# Altium project Kojiki.PrjPCB (part 1 of 2)
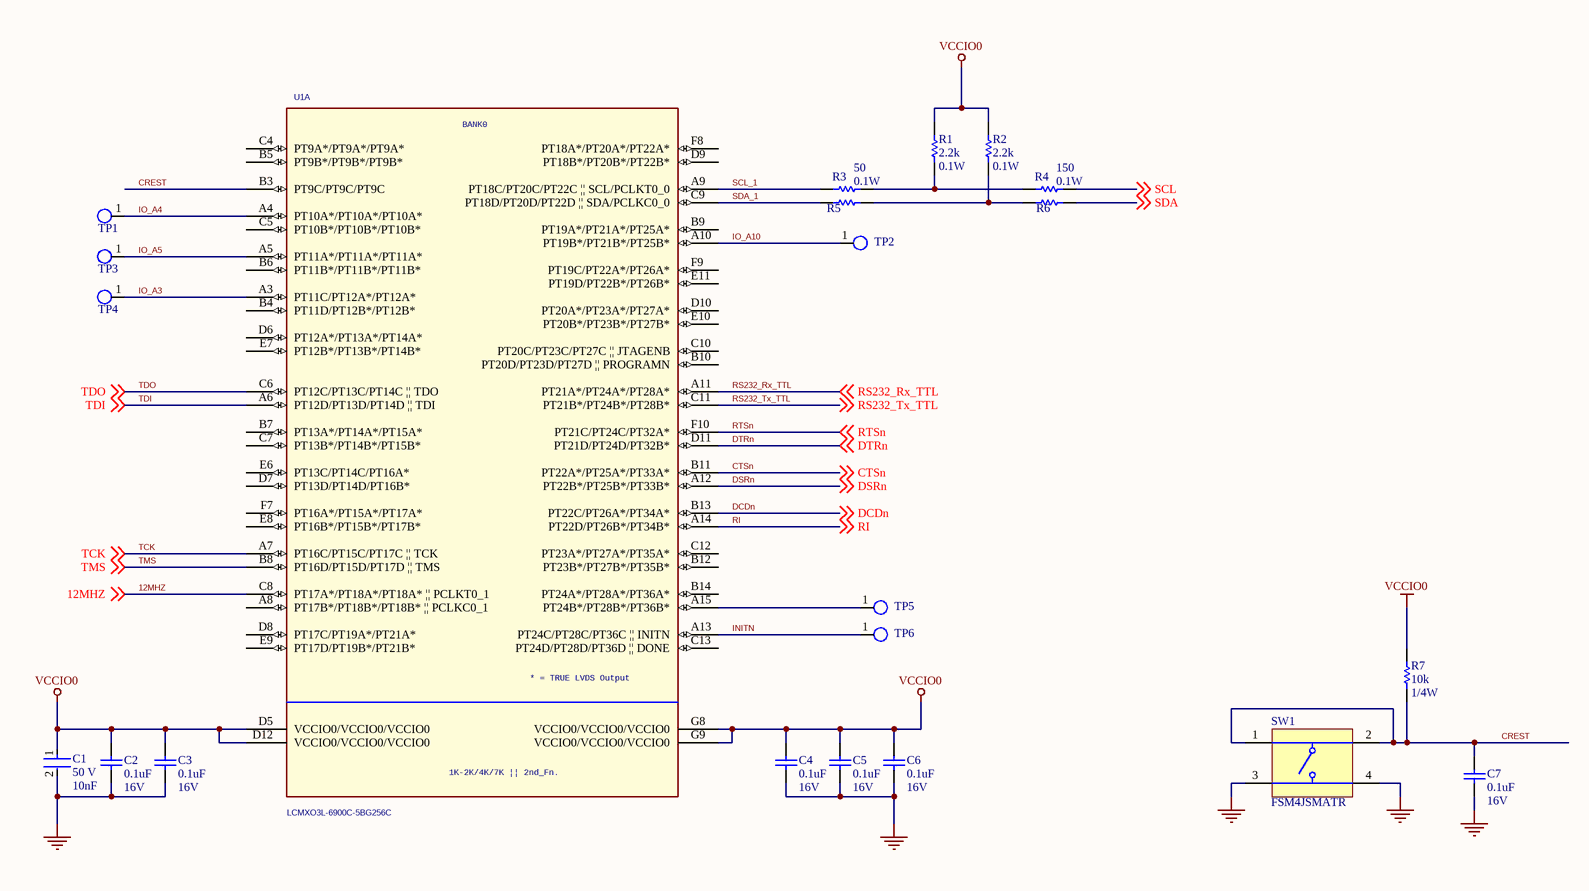
[diagram p0: Bank0_I_O.SchDoc]
10 sheets, 266 parts. Net scope: global (net labels, ports and power ports of the same name join across sheets).
Board file: Kojiki.PcbDoc
Sheets:
  Bank0_I_O.SchDoc
  Bank1_I_O.SchDoc
  Bank2_I_O.SchDoc
  Bank3-4-5_I_O.SchDoc
  bluetooth.SchDoc
  DC-DC-Converters.SchDoc
  Power_Decap.SchDoc
  usb2jtag.SchDoc
  analog_front_end.SchDoc
  Accelerometer.SchDoc

## Sheet Bank0_I_O.SchDoc
size A3

### Parts
C1  value 10nF  Voltage: 50 V  [FP-C0805C-DN-MFG]  (hidden comment: C0805C103K5RACAUTO)
C2  value 0.1uF  Voltage: 16V  [CAPC1608X87X35ML15T15]  (hidden comment: C0603C104M4RACTU)
C3  value 0.1uF  Voltage: 16V  [CAPC1608X87X35ML15T15]  (hidden comment: C0603C104M4RACTU)
C4  value 0.1uF  Voltage: 16V  [CAPC1608X87X35ML15T15]  (hidden comment: C0603C104M4RACTU)
C5  value 0.1uF  Voltage: 16V  [CAPC1608X87X35ML15T15]  (hidden comment: C0603C104M4RACTU)
C6  value 0.1uF  Voltage: 16V  [CAPC1608X87X35ML15T15]  (hidden comment: C0603C104M4RACTU)
C7  value 0.1uF  Voltage: 16V  [CAPC1608X87X35ML15T15]  (hidden comment: C0603C104M4RACTU)
R1  value 2.2k  Power: 0.1W  [RESC1608X55X25LL10T15]  (hidden comment: RC0603FR-072K2L)
R2  value 2.2k  Power: 0.1W  [RESC1608X55X25LL10T15]  (hidden comment: RC0603FR-072K2L)
R3  value 50  Power: 0.1W  [RESC1609X50X30NL10T20]  (hidden comment: CRCW060350R0FKEA)
R4  value 150  Power: 0.1W  [RESC1608X55X30NL15T15]  (hidden comment: ERJ-3EKF1500V)
R5  CRCW060350R0FKEA  [RESC1609X50X30NL10T20]  (value not drawn)
R6  ERJ-3EKF1500V  [RESC1608X55X30NL15T15]  (value not drawn)
R7  value 10k  Power: 1/4W  [RESC3216X70X50NL05T20]  (hidden comment: ERJ-8GEYJ103V)
SW1  FSM4JSMATR  [TECO-FSM4JSMATR_V]
TP1  Test_Point_SMD  [Test_Point_SMD]  (value not drawn)
TP2  Test_Point_SMD  [Test_Point_SMD]  (value not drawn)
TP3  Test_Point_SMD  [Test_Point_SMD]  (value not drawn)
TP4  Test_Point_SMD  [Test_Point_SMD]  (value not drawn)
TP5  Test_Point_SMD  [Test_Point_SMD]  (value not drawn)
TP6  Test_Point_SMD  [Test_Point_SMD]  (value not drawn)
U1  LCMXO3L-6900C-5BG256C  [BGA256C80P16X16_1400X1400X170]  (part A of 7)

### Nets
GND: C1.2 C2.2 C3.2 C4.2 C5.2 C6.2 C7.2 SW1.3 SW1.4
VCCIO0: C1.1 C2.1 C3.1 C4.1 C5.1 C6.1 R1.2 R2.2 R7.1 U1.D5(VCCIO0/VCCIO0/VCCIO0) U1.D12(VCCIO0/VCCIO0/VCCIO0) U1.G8(VCCIO0/VCCIO0/VCCIO0) U1.G9(VCCIO0/VCCIO0/VCCIO0)
12MHZ: U1.C8(PT17A*/PT18A*/PT18A*_||_PCLKT0_1) ; off-sheet 12MHZ
CREST: C7.1 R7.2 SW1.1 SW1.2 U1.B3(PT9C/PT9C/PT9C)
CTSn: U1.B11(PT22A*/PT25A*/PT33A*) ; off-sheet CTSn
DCDn: U1.B13(PT22C/PT26A*/PT34A*) ; off-sheet DCDn
DSRn: U1.A12(PT22B*/PT25B*/PT33B*) ; off-sheet DSRn
DTRn: U1.D11(PT21D/PT24D/PT32B*) ; off-sheet DTRn
INITN: TP6.1(TP) U1.A13(PT24C/PT28C/PT36C_||_INITN)
IO_A3: TP4.1(TP) U1.A3(PT11C/PT12A*/PT12A*)
IO_A4: TP1.1(TP) U1.A4(PT10A*/PT10A*/PT10A*)
IO_A5: TP3.1(TP) U1.A5(PT11A*/PT11A*/PT11A*)
IO_A10: TP2.1(TP) U1.A10(PT19B*/PT21B*/PT25B*)
RI: U1.A14(PT22D/PT26B*/PT34B*) ; off-sheet RI
RS232_Rx_TTL: U1.A11(PT21A*/PT24A*/PT28A*) ; off-sheet RS232_Rx_TTL
RS232_Tx_TTL: U1.C11(PT21B*/PT24B*/PT28B*) ; off-sheet RS232_Tx_TTL
RTSn: U1.F10(PT21C/PT24C/PT32A*) ; off-sheet RTSn
SCL: R4.2 ; off-sheet SCL
SCL_1: R3.1 U1.A9(PT18C/PT20C/PT22C_||_SCL/PCLKT0_0)
SDA: R6.2 ; off-sheet SDA
SDA_1: R5.1 U1.C9(PT18D/PT20D/PT22D_||_SDA/PCLKC0_0)
TCK: U1.A7(PT16C/PT15C/PT17C_||_TCK) ; off-sheet TCK
TDI: U1.A6(PT12D/PT13D/PT14D_||_TDI) ; off-sheet TDI
TDO: U1.C6(PT12C/PT13C/PT14C_||_TDO) ; off-sheet TDO
TMS: U1.B8(PT16D/PT15D/PT17D_||_TMS) ; off-sheet TMS
NetR1_1: R1.1 R3.2 R4.1
NetR2_1: R2.1 R5.2 R6.1
NetTP5_1: TP5.1(TP) U1.A15(PT24B*/PT28B*/PT36B*)

Not connected (* = marked no-connect by the designer): U1 A8(PT17B*/PT18B*/PT18B*_||_PCLKC0_1) B4(PT11D/PT12B*/PT12B*) B5(PT9B*/PT9B*/PT9B*) B6(PT11B*/PT11B*/PT11B*) B7(PT13A*/PT14A*/PT15A*) B9(PT19A*/PT21A*/PT25A*) B10(PT20D/PT23D/PT27D_||_PROGRAMN) B12(PT23B*/PT27B*/PT35B*) B14(PT24A*/PT28A*/PT36A*) C4(PT9A*/PT9A*/PT9A*) C5(PT10B*/PT10B*/PT10B*) C7(PT13B*/PT14B*/PT15B*) C10(PT20C/PT23C/PT27C_||_JTAGENB) C12(PT23A*/PT27A*/PT35A*) C13(PT24D/PT28D/PT36D_||_DONE) D6(PT12A*/PT13A*/PT14A*) D7(PT13D/PT14D/PT16B*) D8(PT17C/PT19A*/PT21A*) D9(PT18B*/PT20B*/PT22B*) D10(PT20A*/PT23A*/PT27A*) E6(PT13C/PT14C/PT16A*) E7(PT12B*/PT13B*/PT14B*) E8(PT16B*/PT15B*/PT17B*) E9(PT17D/PT19B*/PT21B*) E10(PT20B*/PT23B*/PT27B*) E11(PT19D/PT22B*/PT26B*) F7(PT16A*/PT15A*/PT17A*) F8(PT18A*/PT20A*/PT22A*) F9(PT19C/PT22A*/PT26A*)

### Notes on the sheet
- Title
- Size:
- Date:
- A3
- Number:
- Time:
- Revision:
- Sheet
- of
- File:
- (in symbol LCMXO3L-1K/2K/4K/7K-BG256, part A) BANK0; * = TRUE LVDS Output; 1K-2K/4K/7K || 2nd_Fn.

### Library data of the parts
C1 = CMP-03020-006206-1: CAP CER 10000PF 50V X7R 0805; Manufacturer: KEMET; Material: Ceramic; Temperature Coefficient: 30ppm/°C; Alternative1: GRM21BR72A103KA01L Murata; Alternative2: C0805F103K5RACTU KEMET; Alternative3: 08055C103JAT2A Kyocera AVX; Height: 0.88mm; Temperature Characteristic: X7R; Part Number: C0805C103K5RACAUTO; ComponentLink2URL: https://content.kemet.com/datasheets/KEM_C1003_C0G_SMD.pdf; RoHS: TRUE; Temperature: -55°C to +125°C; Temperature Range Low: -55°C; ComponentLink2Description: Datasheet; Package / Case: C0805C-DN; Lead Free: Yes
C2-C7 = CMP-2006-03067-1: Ceramic Capacitor 0.1uF 16V +-10% X7R0603; Manufacturer: Kemet; Alternative1: C1608X7R1E104K TDK; Alternative2: CC0603KRX7R8BB104 Yageo; Alternative3: GRM188R72A104KA35D Murata; Part Number: C0603C104M4RACTU; Package / Case: 0603
R1 R2 = CMP-2000-06934-1: Thick Film Resistor, 2.2 KOhm, 100 mW, 50 V, +/- 1%, -55 to 155 degC, 2-Pin SMD (0603), RoHS, Tape and Reel; Manufacturer: Yageo; Temperature Coefficient: 100PPM/C; Voltage: 50V; Alternative1: RC0603FR-102K2L Yageo; Alternative2: RMCF0603FT2K20 Stackpole Electronics; Alternative3: CRCW06032K20FKEA Vishay; Tolerance: 1%; Datasheet Version: Rev. 7, 05/2017; Case Code - mm: 1608; Series: RC; Mounting Technology: SurfaceMount; Package Description: 2-Pin Surface Mount Device, Body 1.6 x 0.8 mm; Package / Case: 0603; Package Reference: 0603; Product: ThickFilmResistorsGeneralPurpose; Manufacturer URL: http://www.yageo.com/; Termination Style: SMD/SMT; Operating Temperature Range: -55Cto+155C; Datasheet URL: http://www.yageo.com/documents/recent/PYu-RC_Group_51_RoHS_L_7.pdf; Packaging: Reel
R3 = CMP-2000-03436-1: Manufacturer: Vishay Dale; Part Number: CRCW060350R0FKEA
R4 = CMP-2000-00256-1: Manufacturer: Panasonic; Part Number: ERJ-3EKF1500V
R5 = CMP-2000-03436-1: Manufacturer: Vishay Dale; Value: 50; Power: 0.1W; Part Number: CRCW060350R0FKEA
R6 = CMP-2000-00256-1: Manufacturer: Panasonic; Value: 150; Power: 0.1W; Part Number: ERJ-3EKF1500V
R7 = CMP-2003-00545-1: Res Thick Film 1206 10k Ohms 5% 1/4W; Manufacturer: Panasonic; Alternative1: CR1206F-10KFI TT Welwyn; Alternative2: WR12X1002FGL Walsin Technologies; Alternative3: CR1206-FX-1002ELF Bourns; Part Number: ERJ-8GEYJ103V; Package / Case: 1206
SW1 = CMP-2000-07486-1: Micro Miniature Push Button Switch FSM JSM, 50 mA, -35 to 85 degC, 4-Pin SMD, RoHS, Tape and Reel; Manufacturer: TE Connectivity; Mechanical Life: 100000Cycles; Current Rating: 50mA; Actuator Material: Polyamide; Max Voltage Rating (DC): 12V; Capacitance: 0f; Illumination Type: Illuminated; Voltage Rating (DC): 24V; Case\/Package: SMD/SMT; Operating Force: 160gf; Contact Resistance: 100mOhm; Actuator Length: 0.055inch; Switch Travel: 0.25mm; Throw Configuration: SPST; Termination: GullWing; Contact Plating: Silver; Orientation: Straight; Mounting Technology: SurfaceMount; REACH SVHC: Unknown; Electrical Life: 100000Cycles; Package Reference: FSM4JSMATR; Max Operating Temperature: 85degC; Manufacturer URL: http://www.te.com/; Package Description: 4-Pin Surface Mount Device, Body 6 x 6 mm, Pitch 4.5 mm; Datasheet Version: Rev. V, 02/2015; Packaging: TapeandReel; Min Operating Temperature: -35degC; Mount: SurfaceMount; Contact Current Rating: 50mA; Contact Material: CopperAlloy; Package Quantity: 1200; Datasheet URL: http://www.te.com/commerce/DocumentDelivery/DDEController?Action=showdoc&DocId=Customer+Drawing%7F2-1437565-7%7FV%7Fpdf%7FEnglish%7FENG_CD_2-1437565-7_V.pdf%7F4-1437565-2; RoHSCompliant: true
U1 = LCMXO3L-1K/2K/4K/7K-BG256: IC FPGA 6864LUTS 256BGA; Manufacturer: Lattice semi; SPLIT_INST: TRUE; SWAP_INFO: (S1+S2+S3+S4+S5+S6+S7); Manufacturer Part Number: LCMXO3L-6900C-5BG256C; Digikey P/N: 220-1886-ND

## Sheet Bank1_I_O.SchDoc
size A3
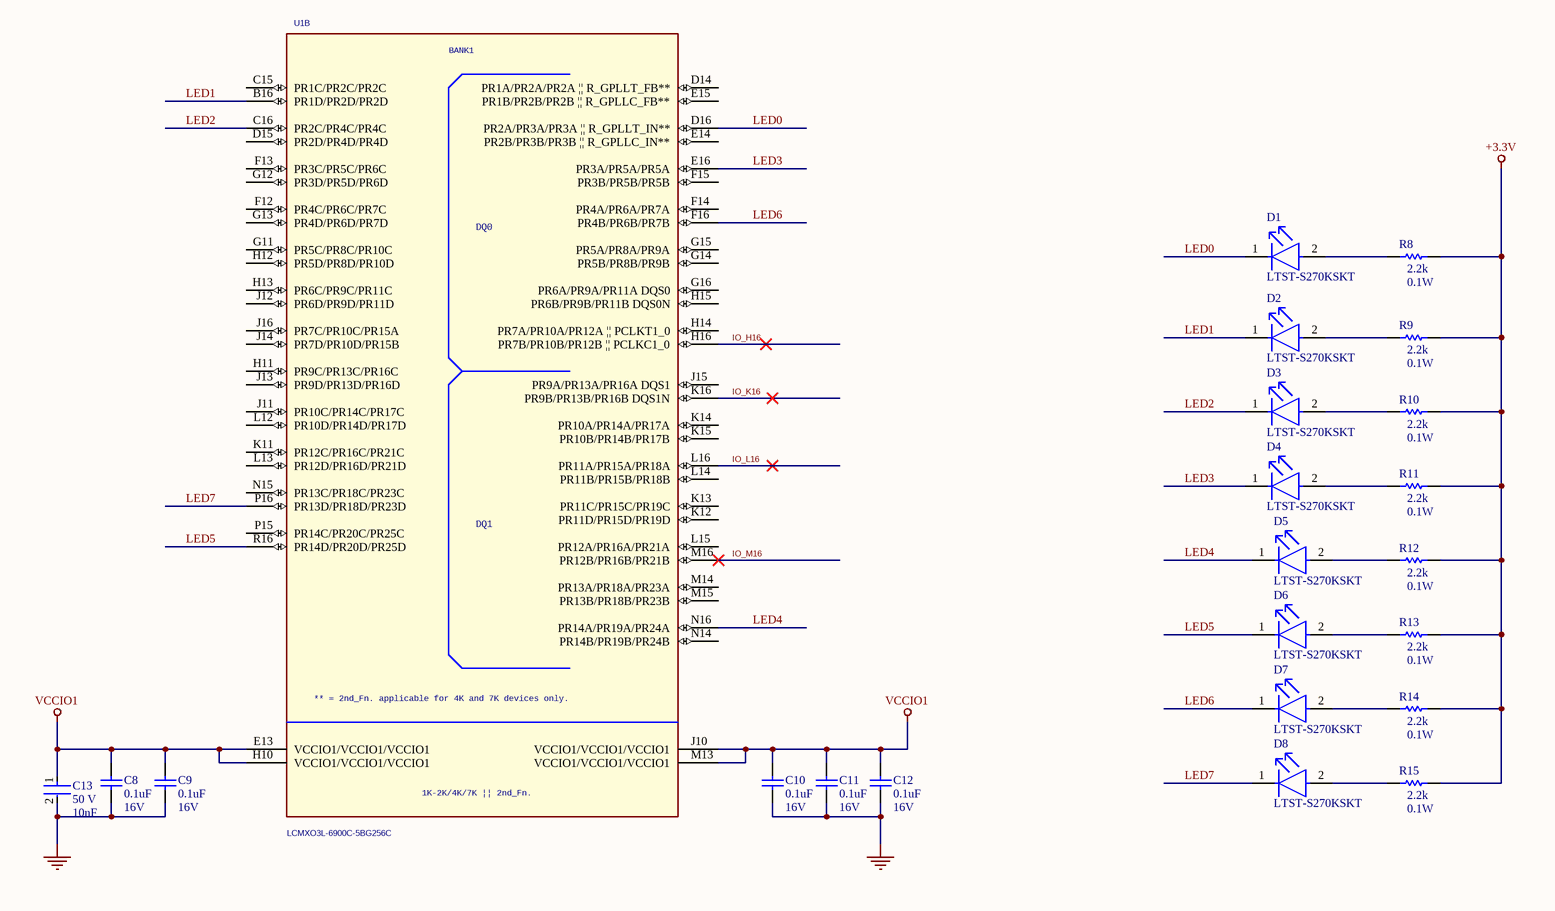
[diagram p1: Bank1_I_O.SchDoc]

### Parts
C8  value 0.1uF  Voltage: 16V  [CAPC1608X87X35ML15T15]  (hidden comment: C0603C104M4RACTU)
C9  value 0.1uF  Voltage: 16V  [CAPC1608X87X35ML15T15]  (hidden comment: C0603C104M4RACTU)
C10  value 0.1uF  Voltage: 16V  [CAPC1608X87X35ML15T15]  (hidden comment: C0603C104M4RACTU)
C11  value 0.1uF  Voltage: 16V  [CAPC1608X87X35ML15T15]  (hidden comment: C0603C104M4RACTU)
C12  value 0.1uF  Voltage: 16V  [CAPC1608X87X35ML15T15]  (hidden comment: C0603C104M4RACTU)
C13  value 10nF  Voltage: 50 V  [FP-C0805C-DN-MFG]  (hidden comment: C0805C103K5RACAUTO)
D1  LTST-S270KSKT  [FP-LTST-S270KSKT-MFG]
D2  LTST-S270KSKT  [FP-LTST-S270KSKT-MFG]
D3  LTST-S270KSKT  [FP-LTST-S270KSKT-MFG]
D4  LTST-S270KSKT  [FP-LTST-S270KSKT-MFG]
D5  LTST-S270KSKT  [FP-LTST-S270KSKT-MFG]
D6  LTST-S270KSKT  [FP-LTST-S270KSKT-MFG]
D7  LTST-S270KSKT  [FP-LTST-S270KSKT-MFG]
D8  LTST-S270KSKT  [FP-LTST-S270KSKT-MFG]
R8  value 2.2k  Power: 0.1W  [RESC1608X55X25LL10T15]  (hidden comment: RC0603FR-072K2L)
R9  value 2.2k  Power: 0.1W  [RESC1608X55X25LL10T15]  (hidden comment: RC0603FR-072K2L)
R10  value 2.2k  Power: 0.1W  [RESC1608X55X25LL10T15]  (hidden comment: RC0603FR-072K2L)
R11  value 2.2k  Power: 0.1W  [RESC1608X55X25LL10T15]  (hidden comment: RC0603FR-072K2L)
R12  value 2.2k  Power: 0.1W  [RESC1608X55X25LL10T15]  (hidden comment: RC0603FR-072K2L)
R13  value 2.2k  Power: 0.1W  [RESC1608X55X25LL10T15]  (hidden comment: RC0603FR-072K2L)
R14  value 2.2k  Power: 0.1W  [RESC1608X55X25LL10T15]  (hidden comment: RC0603FR-072K2L)
R15  value 2.2k  Power: 0.1W  [RESC1608X55X25LL10T15]  (hidden comment: RC0603FR-072K2L)
U1  LCMXO3L-6900C-5BG256C  [BGA256C80P16X16_1400X1400X170]  (part B of 7)

### Nets
+3.3V: R8.2 R9.2 R10.2 R11.2 R12.2 R13.2 R14.2 R15.2
GND: C8.2 C9.2 C10.2 C11.2 C12.2 C13.2
VCCIO1: C8.1 C9.1 C10.1 C11.1 C12.1 C13.1 U1.E13(VCCIO1/VCCIO1/VCCIO1) U1.H10(VCCIO1/VCCIO1/VCCIO1) U1.J10(VCCIO1/VCCIO1/VCCIO1) U1.M13(VCCIO1/VCCIO1/VCCIO1)
IO_H16: U1.H16(PR7B/PR10B/PR12B_||_PCLKC1_0)
IO_K16: U1.K16(PR9B/PR13B/PR16B_DQS1N)
IO_L16: U1.L16(PR11A/PR15A/PR18A)
IO_M16: U1.M16(PR12B/PR16B/PR21B)
LED0: D1.1(C) U1.D16(PR2A/PR3A/PR3A_||_R_GPLLT_IN**)
LED1: D2.1(C) U1.B16(PR1D/PR2D/PR2D)
LED2: D3.1(C) U1.C16(PR2C/PR4C/PR4C)
LED3: D4.1(C) U1.E16(PR3A/PR5A/PR5A)
LED4: D5.1(C) U1.N16(PR14A/PR19A/PR24A)
LED5: D6.1(C) U1.R16(PR14D/PR20D/PR25D)
LED6: D7.1(C) U1.F16(PR4B/PR6B/PR7B)
LED7: D8.1(C) U1.P16(PR13D/PR18D/PR23D)
NetD1_2: D1.2(A) R8.1
NetD2_2: D2.2(A) R9.1
NetD3_2: D3.2(A) R10.1
NetD4_2: D4.2(A) R11.1
NetD5_2: D5.2(A) R12.1
NetD6_2: D6.2(A) R13.1
NetD7_2: D7.2(A) R14.1
NetD8_2: D8.2(A) R15.1

Not connected (* = marked no-connect by the designer): U1 C15(PR1C/PR2C/PR2C) D14(PR1A/PR2A/PR2A_||_R_GPLLT_FB**) D15(PR2D/PR4D/PR4D) E14(PR2B/PR3B/PR3B_||_R_GPLLC_IN**) E15(PR1B/PR2B/PR2B_||_R_GPLLC_FB**) F12(PR4C/PR6C/PR7C) F13(PR3C/PR5C/PR6C) F14(PR4A/PR6A/PR7A) F15(PR3B/PR5B/PR5B) G11(PR5C/PR8C/PR10C) G12(PR3D/PR5D/PR6D) G13(PR4D/PR6D/PR7D) G14(PR5B/PR8B/PR9B) G15(PR5A/PR8A/PR9A) G16(PR6A/PR9A/PR11A_DQS0) H11(PR9C/PR13C/PR16C) H12(PR5D/PR8D/PR10D) H13(PR6C/PR9C/PR11C) H14(PR7A/PR10A/PR12A_||_PCLKT1_0) H15(PR6B/PR9B/PR11B_DQS0N) J11(PR10C/PR14C/PR17C) J12(PR6D/PR9D/PR11D) J13(PR9D/PR13D/PR16D) J14(PR7D/PR10D/PR15B) J15(PR9A/PR13A/PR16A_DQS1) J16(PR7C/PR10C/PR15A) K11(PR12C/PR16C/PR21C) K12(PR11D/PR15D/PR19D) K13(PR11C/PR15C/PR19C) K14(PR10A/PR14A/PR17A) K15(PR10B/PR14B/PR17B) L12(PR10D/PR14D/PR17D) L13(PR12D/PR16D/PR21D) L14(PR11B/PR15B/PR18B) L15(PR12A/PR16A/PR21A) M14(PR13A/PR18A/PR23A) M15(PR13B/PR18B/PR23B) N14(PR14B/PR19B/PR24B) N15(PR13C/PR18C/PR23C) P15(PR14C/PR20C/PR25C)

### Notes on the sheet
- Title
- Size:
- Date:
- A3
- Number:
- Time:
- Revision:
- Sheet
- of
- File:
- (in symbol LCMXO3L-1K/2K/4K/7K-BG256, part B) BANK1; DQ0; DQ1; ** = 2nd_Fn. applicable for 4K and 7K devices only.; 1K-2K/4K/7K || 2nd_Fn.

### Library data of the parts
C8-C12 = CMP-2006-03067-1: as C2 on sheet Bank0_I_O; Part Number: C0603C104M4RACTU; Package / Case: 0603
C13 = CMP-03020-006206-1: as C1 on sheet Bank0_I_O; Height: 0.88mm; Temperature Characteristic: X7R; Part Number: C0805C103K5RACAUTO; ComponentLink2URL: https://content.kemet.com/datasheets/KEM_C1003_C0G_SMD.pdf; RoHS: TRUE; Temperature: -55°C to +125°C; Temperature Range Low: -55°C; ComponentLink2Description: Datasheet; Package / Case: C0805C-DN; Lead Free: Yes
D1-D8 = CMP-22017-000015-1: LED YELLOW CLEAR CHIP SMD R/A; Wavelength: 591nm; Lens Color: Colorless; Dominant Wavelength: 587nm; Reverse Voltage: 5V; Test Current: 20mA; Forward Current: 30mA; Power Dissipation: 75mW; Number of Elements: 1; Viewing Angle: 130°; Forward Voltage: 2V; Lens Style: Diffused; Luminous Intensity: 80mcd; Max Operating Temperature: 85°C; Lead Free: Lead Free; Case Code (Metric): 1608; Number of Pins: 2; Package Quantity: 1; Height: 0.6mm; Illumination Color: Yellow; Mount: Surface Mount; Case Code (Imperial): 0603; Length: 1.6mm; Packaging: Tape and Reel; Radiation Hardening: No; Width: 1.15mm; Depth: 0.6mm; Lens Transparency: Clear; Case/Package: 0603; Number of LEDs: 1; Power Rating: 75mW; Color: Yellow; Min Operating Temperature: -55°C
R8-R15 = CMP-2000-06934-1: as R1 on sheet Bank0_I_O; Tolerance: 1%; Datasheet Version: Rev. 7, 05/2017; Case Code - mm: 1608; Series: RC; Mounting Technology: SurfaceMount; Package Description: 2-Pin Surface Mount Device, Body 1.6 x 0.8 mm; Package / Case: 0603; Package Reference: 0603; Product: ThickFilmResistorsGeneralPurpose; Manufacturer URL: http://www.yageo.com/; Termination Style: SMD/SMT; Operating Temperature Range: -55Cto+155C; Datasheet URL: http://www.yageo.com/documents/recent/PYu-RC_Group_51_RoHS_L_7.pdf; Packaging: Reel
U1 = LCMXO3L-1K/2K/4K/7K-BG256: IC FPGA 6864LUTS 256BGA; Manufacturer: Lattice semi; SPLIT_INST: TRUE; SWAP_INFO: (S1+S2+S3+S4+S5+S6+S7); Graphic: LCMXO3L-1K/2K/4K/7K-BG256A.Normal; Power Pins Visible: False; Source Library: D:\DESIGN_DOC\XO3\LATTICEORCADCAPTURESCHEMATICLIBRARYOLB\LATTICEORCADCAPTURESCHEMATICLIBRARYOLB\LATTICE_SYM\LATTICEPLDS.OLB; Location Y-Coordinate: 0; Implementation Type: <none>; Primitive: DEFAULT; Name: I16790692; Digikey P/N: 220-1886-ND; Source Package: LCMXO3L-1K/2K/4K/7K-BG256; Source Part: LCMXO3L-1K/2K/4K/7K-BG256A.Normal; Color: Default; Location X-Coordinate: 0; Manufacturer Part Number: LCMXO3L-6900C-5BG256C

## Sheet Bank2_I_O.SchDoc
size A3
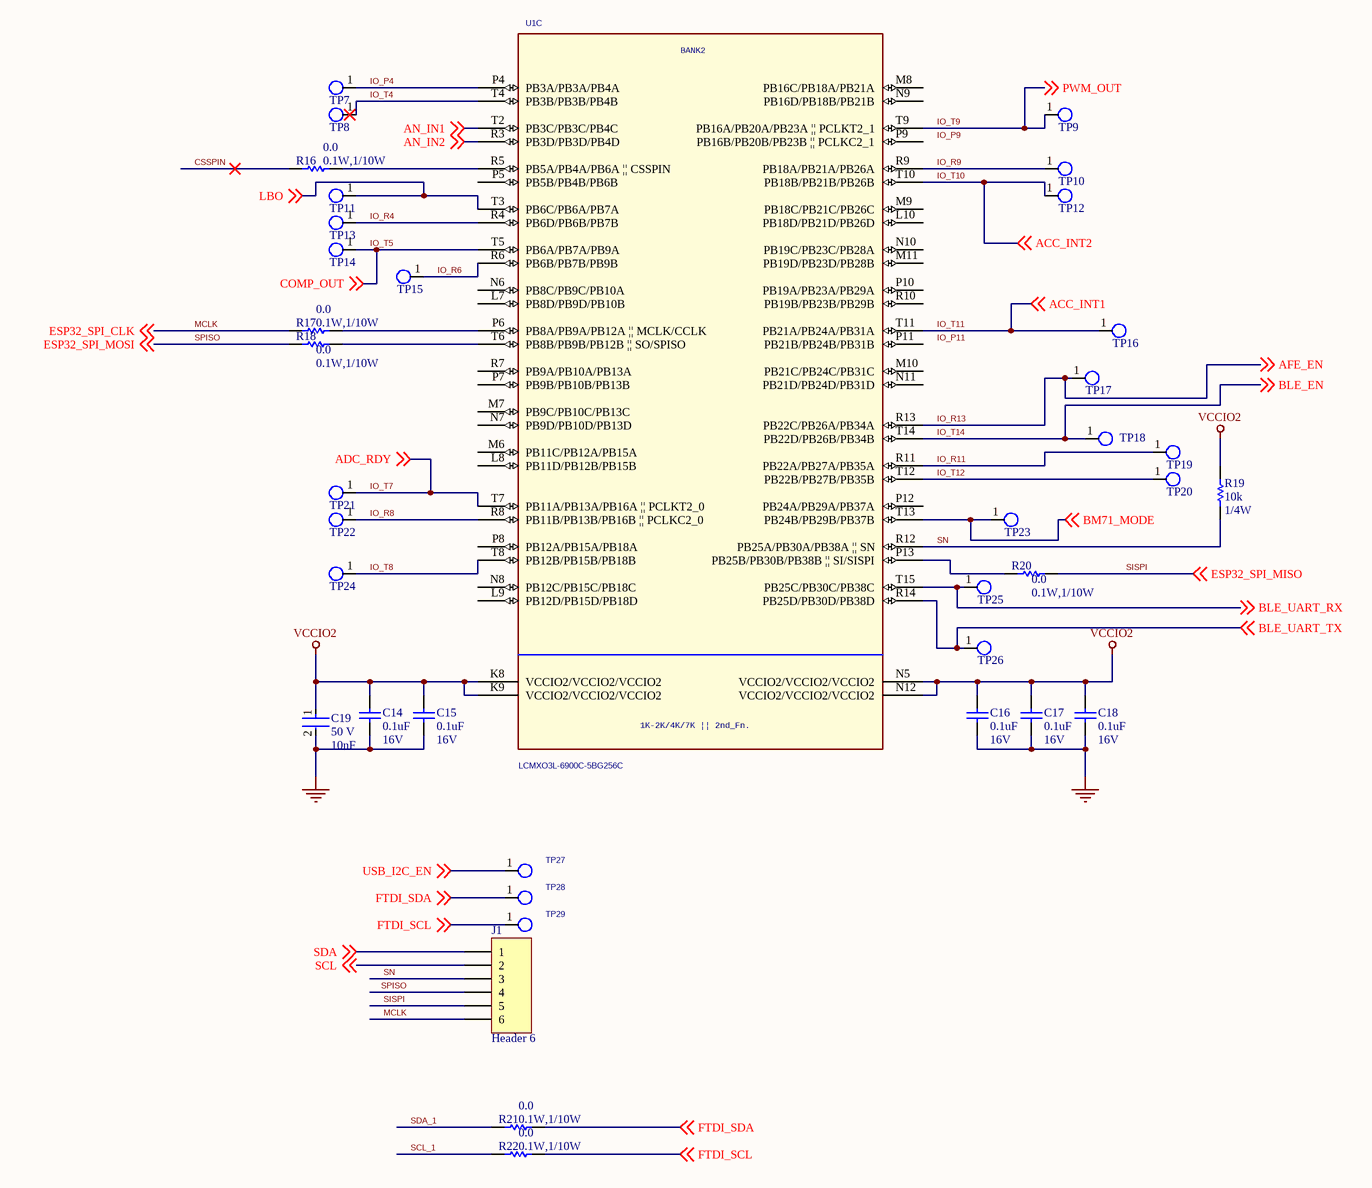
[diagram p2: Bank2_I_O.SchDoc]

### Parts
C14  value 0.1uF  Voltage: 16V  [CAPC1608X87X35ML15T15]  (hidden comment: C0603C104M4RACTU)
C15  value 0.1uF  Voltage: 16V  [CAPC1608X87X35ML15T15]  (hidden comment: C0603C104M4RACTU)
C16  value 0.1uF  Voltage: 16V  [CAPC1608X87X35ML15T15]  (hidden comment: C0603C104M4RACTU)
C17  value 0.1uF  Voltage: 16V  [CAPC1608X87X35ML15T15]  (hidden comment: C0603C104M4RACTU)
C18  value 0.1uF  Voltage: 16V  [CAPC1608X87X35ML15T15]  (hidden comment: C0603C104M4RACTU)
C19  value 10nF  Voltage: 50 V  [FP-C0805C-DN-MFG]  (hidden comment: C0805C103K5RACAUTO)
J1  Header 6  [HDR1X6]
R16  value 0.0  Power: 0.1W,1/10W  [RESC1608X55X35LL10T10]  (hidden comment: RC1608J000CS)
R17  value 0.0  Power: 0.1W,1/10W  [RESC1608X55X35LL10T10]  (hidden comment: RC1608J000CS)
R18  value 0.0  Power: 0.1W,1/10W  [RESC1608X55X35LL10T10]  (hidden comment: RC1608J000CS)
R19  value 10k  Power: 1/4W  [RESC3216X70X50NL05T20]  (hidden comment: ERJ-8GEYJ103V)
R20  value 0.0  Power: 0.1W,1/10W  [RESC1608X55X35LL10T10]  (hidden comment: RC1608J000CS)
R21  value 0.0  Power: 0.1W,1/10W  [RESC1608X55X35LL10T10]  (hidden comment: RC1608J000CS)
R22  value 0.0  Power: 0.1W,1/10W  [RESC1608X55X35LL10T10]  (hidden comment: RC1608J000CS)
TP7  Test_Point_SMD  [Test_Point_SMD]  (value not drawn)
TP8  Test_Point_SMD  [Test_Point_SMD]  (value not drawn)
TP9  Test_Point_SMD  [Test_Point_SMD]  (value not drawn)
TP10  Test_Point_SMD  [Test_Point_SMD]  (value not drawn)
TP11  Test_Point_SMD  [Test_Point_SMD]  (value not drawn)
TP12  Test_Point_SMD  [Test_Point_SMD]  (value not drawn)
TP13  Test_Point_SMD  [Test_Point_SMD]  (value not drawn)
TP14  Test_Point_SMD  [Test_Point_SMD]  (value not drawn)
TP15  Test_Point_SMD  [Test_Point_SMD]  (value not drawn)
TP16  Test_Point_SMD  [Test_Point_SMD]  (value not drawn)
TP17  Test_Point_SMD  [Test_Point_SMD]  (value not drawn)
TP18  Test_Point_SMD  [Test_Point_SMD]  (value not drawn)
TP19  Test_Point_SMD  [Test_Point_SMD]  (value not drawn)
TP20  Test_Point_SMD  [Test_Point_SMD]  (value not drawn)
TP21  Test_Point_SMD  [Test_Point_SMD]  (value not drawn)
TP22  Test_Point_SMD  [Test_Point_SMD]  (value not drawn)
TP23  Test_Point_SMD  [Test_Point_SMD]  (value not drawn)
TP24  Test_Point_SMD  [Test_Point_SMD]  (value not drawn)
TP25  Test_Point_SMD  [Test_Point_SMD]  (value not drawn)
TP26  Test_Point_SMD  [Test_Point_SMD]  (value not drawn)
TP27  tp_s_40_63  [tp_s_40_63]  (value not drawn)
TP28  tp_s_40_63  [tp_s_40_63]  (value not drawn)
TP29  tp_s_40_63  [tp_s_40_63]  (value not drawn)
U1  LCMXO3L-6900C-5BG256C  [BGA256C80P16X16_1400X1400X170]  (part C of 7)

### Nets
GND: C14.2 C15.2 C16.2 C17.2 C18.2 C19.2
VCCIO2: C14.1 C15.1 C16.1 C17.1 C18.1 C19.1 R19.1 U1.K8(VCCIO2/VCCIO2/VCCIO2) U1.K9(VCCIO2/VCCIO2/VCCIO2) U1.N5(VCCIO2/VCCIO2/VCCIO2) U1.N12(VCCIO2/VCCIO2/VCCIO2)
AN_IN1: U1.T2(PB3C/PB3C/PB4C) ; off-sheet AN_IN1  [project net COMP_IN1]
AN_IN2: U1.R3(PB3D/PB3D/PB4D) ; off-sheet AN_IN2  [project net COMP_IN2]
BLE_UART_RX: TP25.1(TP) U1.T15(PB25C/PB30C/PB38C) ; off-sheet BLE_UART_RX  [project net ESP32_UART_RX]
BLE_UART_TX: TP26.1(TP) U1.R14(PB25D/PB30D/PB38D) ; off-sheet BLE_UART_TX  [project net ESP32_UART_TX]
BM71_MODE: TP23.1(TP) U1.T13(PB24B/PB29B/PB37B) ; off-sheet BM71_MODE
CSSPIN: R16.1
FTDI_SCL: R22.2 TP29.1(TP) ; off-sheet FTDI_SCL
FTDI_SDA: R21.2 TP28.1(TP) ; off-sheet FTDI_SDA
IO_P4: TP7.1(TP) U1.P4(PB3A/PB3A/PB4A)
IO_R4: TP13.1(TP) U1.R4(PB6D/PB6B/PB7B)
IO_R6: TP15.1(TP) U1.R6(PB6B/PB7B/PB9B)
IO_R8: TP22.1(TP) U1.R8(PB11B/PB13B/PB16B_||_PCLKC2_0)
IO_R9: TP10.1(TP) U1.R9(PB18A/PB21A/PB26A)
IO_R11: TP19.1(TP) U1.R11(PB22A/PB27A/PB35A)
IO_R13: TP17.1(TP) U1.R13(PB22C/PB26A/PB34A) ; off-sheet AFE_EN  [also labelled AFE_EN]
IO_T4: TP8.1(TP) U1.T4(PB3B/PB3B/PB4B)
IO_T5: TP14.1(TP) U1.T5(PB6A/PB7A/PB9A) ; off-sheet COMP_OUT  [also labelled COMP_OUT]
IO_T7: TP21.1(TP) U1.T7(PB11A/PB13A/PB16A_||_PCLKT2_0) ; off-sheet ADC_RDY  [also labelled ADC_RDY]
IO_T8: TP24.1(TP) U1.T8(PB12B/PB15B/PB18B)
IO_T9: TP9.1(TP) U1.T9(PB16A/PB20A/PB23A_||_PCLKT2_1) ; off-sheet PWM_OUT  [also labelled PWM_OUT]
IO_T10: TP12.1(TP) U1.T10(PB18B/PB21B/PB26B) ; off-sheet ACC_INT2  [also labelled ACC_INT2]
IO_T11: TP16.1(TP) U1.T11(PB21A/PB24A/PB31A) ; off-sheet ACC_INT1  [also labelled ACC_INT1]
IO_T12: TP20.1(TP) U1.T12(PB22B/PB27B/PB35B)
IO_T14: TP18.1(TP) U1.T14(PB22D/PB26B/PB34B) ; off-sheet BLE_EN  [also labelled BLE_EN]
LBO: TP11.1(TP) U1.T3(PB6C/PB6A/PB7A) ; off-sheet LBO
MCLK: J1.6 R17.1 ; off-sheet ESP32_SPI_CLK  [also labelled ESP32_SPI_CLK]
SCL: J1.2 ; off-sheet SCL
SCL_1: R22.1
SDA: J1.1 ; off-sheet SDA
SDA_1: R21.1
SISPI: J1.5 R20.2 ; off-sheet ESP32_SPI_MISO  [also labelled ESP32_SPI_MISO]
SN: J1.3 R19.2 U1.R12(PB25A/PB30A/PB38A_||_SN)
SPISO: J1.4 R18.1 ; off-sheet ESP32_SPI_MOSI  [also labelled ESP32_SPI_MOSI]
USB_I2C_EN: TP27.1(TP) ; off-sheet USB_I2C_EN
NetR16_2: R16.2 U1.R5(PB5A/PB4A/PB6A_||_CSSPIN)
NetR17_2: R17.2 U1.P6(PB8A/PB9A/PB12A_||_MCLK/CCLK)
NetR18_2: R18.2 U1.T6(PB8B/PB9B/PB12B_||_SO/SPISO)
NetR20_1: R20.1 U1.P13(PB25B/PB30B/PB38B_||_SI/SISPI)

Not connected (* = marked no-connect by the designer): U1 L7(PB8D/PB9D/PB10B) L8(PB11D/PB12B/PB15B) L9(PB12D/PB15D/PB18D) L10(PB18D/PB21D/PB26D) M6(PB11C/PB12A/PB15A) M7(PB9C/PB10C/PB13C) M8(PB16C/PB18A/PB21A) M9(PB18C/PB21C/PB26C) M10(PB21C/PB24C/PB31C) M11(PB19D/PB23D/PB28B) N6(PB8C/PB9C/PB10A) N7(PB9D/PB10D/PB13D) N8(PB12C/PB15C/PB18C) N9(PB16D/PB18B/PB21B) N10(PB19C/PB23C/PB28A) N11(PB21D/PB24D/PB31D) P5(PB5B/PB4B/PB6B) P7(PB9B/PB10B/PB13B) P8(PB12A/PB15A/PB18A) P9(PB16B/PB20B/PB23B_||_PCLKC2_1) P10(PB19A/PB23A/PB29A) P11(PB21B/PB24B/PB31B) P12(PB24A/PB29A/PB37A) R7(PB9A/PB10A/PB13A) R10(PB19B/PB23B/PB29B)

### Notes on the sheet
- Labels drawn without touching a wire or pin: IO_P9, IO_P11
- Title
- Size:
- Date:
- A3
- Number:
- Time:
- Revision:
- Sheet
- of
- File:
- (in symbol LCMXO3L-1K/2K/4K/7K-BG256, part C) BANK2; 1K-2K/4K/7K || 2nd_Fn.

### Library data of the parts
C14-C18 = CMP-2006-03067-1: as C2 on sheet Bank0_I_O; Part Number: C0603C104M4RACTU; Package / Case: 0603
C19 = CMP-03020-006206-1: as C1 on sheet Bank0_I_O; Height: 0.88mm; Temperature Characteristic: X7R; Part Number: C0805C103K5RACAUTO; ComponentLink2URL: https://content.kemet.com/datasheets/KEM_C1003_C0G_SMD.pdf; RoHS: TRUE; Temperature: -55°C to +125°C; Temperature Range Low: -55°C; ComponentLink2Description: Datasheet; Package / Case: C0805C-DN; Lead Free: Yes
J1 = Header 6: Header, 6-Pin; LatestRevisionDate: 17-Jul-2002; LatestRevisionNote: Re-released for DXP Platform.; Publisher: Altium Limited
R16-R18 R20-R22 = CMP-2000-06972-1: Chip Resistor, 0 Ohm, +/- 5%, 0.1 W, -55 to 155 degC, 0603 (1608 Metric), RoHS, Tape and Reel; Manufacturer: Samsung-Electro-Mechanics-America,-Inc.; Tolerance: Jumper; Alternative1: RC0603JR-130RL Yageo; Alternative2: RC0603JR-100RL Yageo; Alternative3: CRCW0603-0000Z0EA Vishay; Manufacturer URL: http://www.samsungsem.com/global/index.jsp; Features: MoistureResistant; Mounting Technology: SurfaceMount; Series: RC; Package / Case: 0603(1608Metric); Category: Resistors; Operating Temperature: -55°C~155°C; Datasheet URL: http://static6.arrow.com/aropdfconversion/3cece72dd289ffbadc164fbcd05f638dd7240f7b/rc_datasheet_150330.pdf.pdf?authToken=eyJ0eXAiOiJKV1QiLCJhbGciOiJIUzI1NiJ9.eyJTZXNzaW9uSWQiOiJtY3ZlYXdxYmptZXdpdXdyeG1ha2FxdWciLCJEb3dubG9hZFR5cGUiOiJEYXRhc2hlZXRzIiwiaXNzIjoic2VsZiIsImF1ZCI6Imh0dHA6Ly9kYXRhc2hlZXRhdXRoLmFycm93LmNvbSIsImV4cCI6MTQ3Njg1OTQ5NiwibmJmIjoxNDc2ODU5Mzc2fQ.1rZWSrRNyHkP6J5YmszFzS2kzmlbN9BKNvWJ4ACiP-Q; Datasheet Version: 09/2015; Composition: ThickFilm; Package Description: 2-Pin Chip Resistor, Body 1.6 x 0.8 mm; Height: 0.022"(0.55mm); Family: ChipResistor-SurfaceMount; Temperature Coefficient: -; Size / Dimension: 0.063"Lx0.031"W(1.60mmx0.80mm); Part Number: RC1608J000CS
R19 = CMP-2003-00545-1: as R7 on sheet Bank0_I_O; Part Number: ERJ-8GEYJ103V; Package / Case: 1206
TP27-TP29 = TP_S_40_63: Square test point, 40mil inner diameter, 63mil outer diameter; Assy: DNI; Class: IO
U1 = LCMXO3L-1K/2K/4K/7K-BG256: IC FPGA 6864LUTS 256BGA; Manufacturer: Lattice semi; Source Part: LCMXO3L-1K/2K/4K/7K-BG256A.Normal; SPLIT_INST: TRUE; SWAP_INFO: (S1+S2+S3+S4+S5+S6+S7); Name: I16790692; Primitive: DEFAULT; Implementation Type: <none>; Location X-Coordinate: 0; Source Library: D:\DESIGN_DOC\XO3\LATTICEORCADCAPTURESCHEMATICLIBRARYOLB\LATTICEORCADCAPTURESCHEMATICLIBRARYOLB\LATTICE_SYM\LATTICEPLDS.OLB; Power Pins Visible: False; Location Y-Coordinate: 0; Color: Default; Source Package: LCMXO3L-1K/2K/4K/7K-BG256; Graphic: LCMXO3L-1K/2K/4K/7K-BG256A.Normal; Manufacturer Part Number: LCMXO3L-6900C-5BG256C; Digikey P/N: 220-1886-ND

## Sheet Bank3-4-5_I_O.SchDoc
size A3
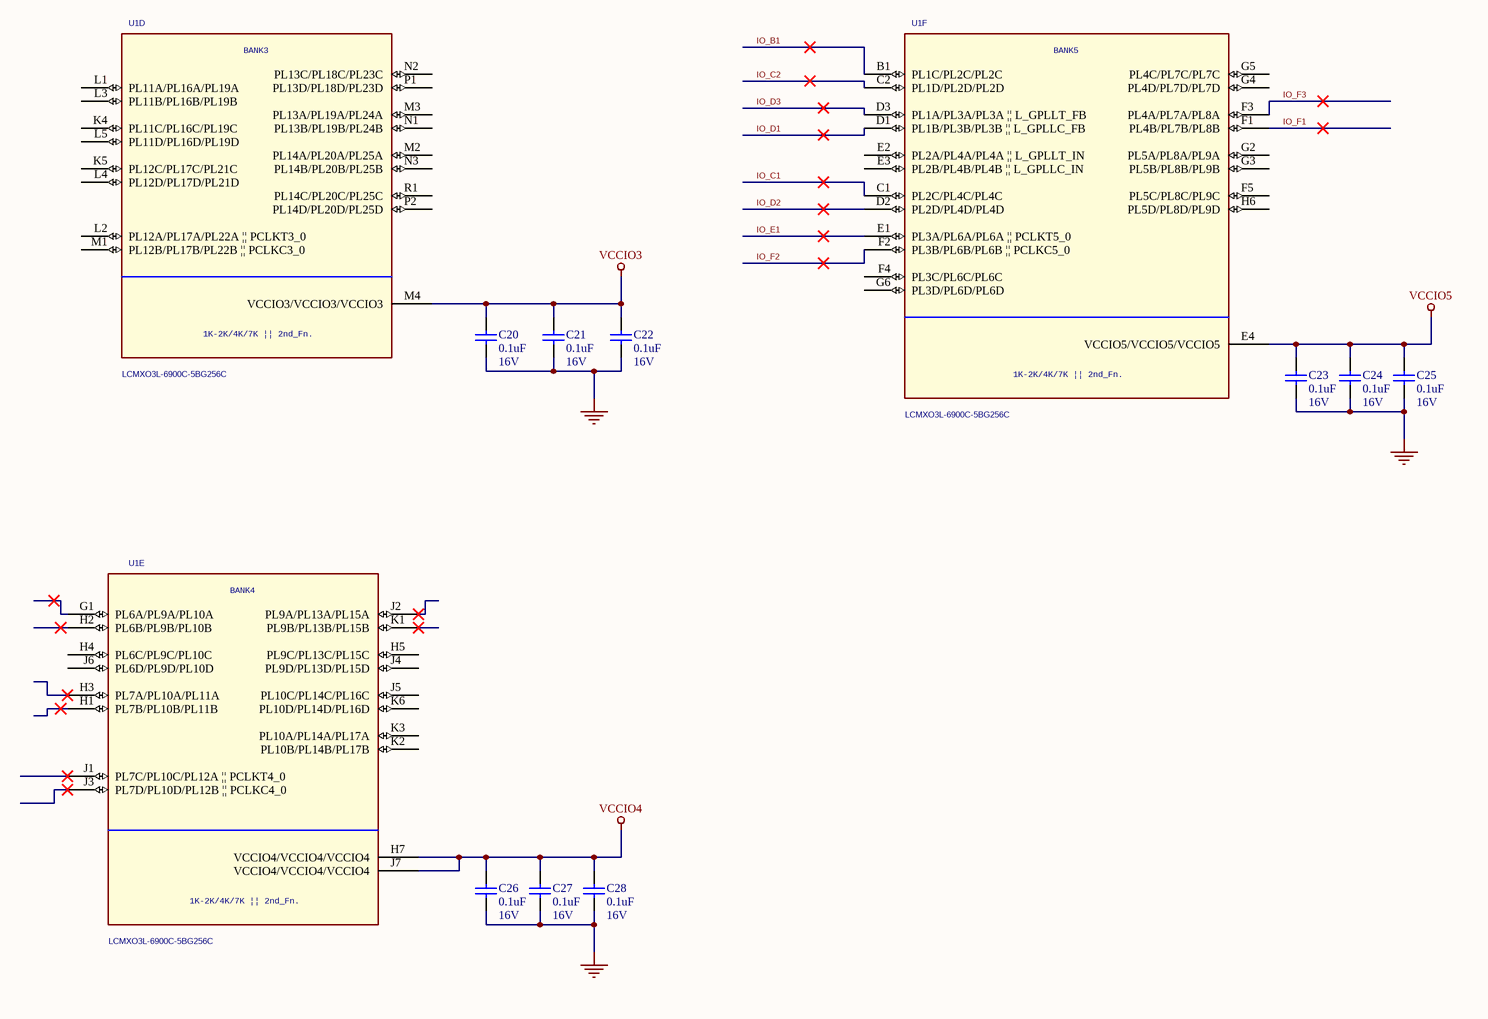
[diagram p3: Bank3-4-5_I_O.SchDoc]

### Parts
C20  value 0.1uF  Voltage: 16V  [CAPC1608X87X35ML15T15]  (hidden comment: C0603C104M4RACTU)
C21  value 0.1uF  Voltage: 16V  [CAPC1608X87X35ML15T15]  (hidden comment: C0603C104M4RACTU)
C22  value 0.1uF  Voltage: 16V  [CAPC1608X87X35ML15T15]  (hidden comment: C0603C104M4RACTU)
C23  value 0.1uF  Voltage: 16V  [CAPC1608X87X35ML15T15]  (hidden comment: C0603C104M4RACTU)
C24  value 0.1uF  Voltage: 16V  [CAPC1608X87X35ML15T15]  (hidden comment: C0603C104M4RACTU)
C25  value 0.1uF  Voltage: 16V  [CAPC1608X87X35ML15T15]  (hidden comment: C0603C104M4RACTU)
C26  value 0.1uF  Voltage: 16V  [CAPC1608X87X35ML15T15]  (hidden comment: C0603C104M4RACTU)
C27  value 0.1uF  Voltage: 16V  [CAPC1608X87X35ML15T15]  (hidden comment: C0603C104M4RACTU)
C28  value 0.1uF  Voltage: 16V  [CAPC1608X87X35ML15T15]  (hidden comment: C0603C104M4RACTU)
U1  LCMXO3L-6900C-5BG256C  [BGA256C80P16X16_1400X1400X170]  (parts D,E,F of 7)

### Nets
GND: C20.2 C21.2 C22.2 C23.2 C24.2 C25.2 C26.2 C27.2 C28.2
VCCIO3: C20.1 C21.1 C22.1 U1.M4(VCCIO3/VCCIO3/VCCIO3)
VCCIO4: C26.1 C27.1 C28.1 U1.H7(VCCIO4/VCCIO4/VCCIO4) U1.J7(VCCIO4/VCCIO4/VCCIO4)
VCCIO5: C23.1 C24.1 C25.1 U1.E4(VCCIO5/VCCIO5/VCCIO5)
IO_B1: U1.B1(PL1C/PL2C/PL2C)
IO_C1: U1.C1(PL2C/PL4C/PL4C)
IO_C2: U1.C2(PL1D/PL2D/PL2D)
IO_D1: U1.D1(PL1B/PL3B/PL3B_||_L_GPLLC_FB)
IO_D2: U1.D2(PL2D/PL4D/PL4D)
IO_D3: U1.D3(PL1A/PL3A/PL3A_||_L_GPLLT_FB)
IO_E1: U1.E1(PL3A/PL6A/PL6A_||_PCLKT5_0)
IO_F1: U1.F1(PL4B/PL7B/PL8B)
IO_F2: U1.F2(PL3B/PL6B/PL6B_||_PCLKC5_0)
IO_F3: U1.F3(PL4A/PL7A/PL8A)

Not connected (* = marked no-connect by the designer): U1 E2(PL2A/PL4A/PL4A_||_L_GPLLT_IN) E3(PL2B/PL4B/PL4B_||_L_GPLLC_IN) F4(PL3C/PL6C/PL6C) F5(PL5C/PL8C/PL9C) G1(PL6A/PL9A/PL10A)* G2(PL5A/PL8A/PL9A) G3(PL5B/PL8B/PL9B) G4(PL4D/PL7D/PL7D) G5(PL4C/PL7C/PL7C) G6(PL3D/PL6D/PL6D) H1(PL7B/PL10B/PL11B)* H2(PL6B/PL9B/PL10B)* H3(PL7A/PL10A/PL11A)* H4(PL6C/PL9C/PL10C) H5(PL9C/PL13C/PL15C) H6(PL5D/PL8D/PL9D) J1(PL7C/PL10C/PL12A_||_PCLKT4_0)* J2(PL9A/PL13A/PL15A)* J3(PL7D/PL10D/PL12B_||_PCLKC4_0)* J4(PL9D/PL13D/PL15D) J5(PL10C/PL14C/PL16C) J6(PL6D/PL9D/PL10D) K1(PL9B/PL13B/PL15B)* K2(PL10B/PL14B/PL17B) K3(PL10A/PL14A/PL17A) K4(PL11C/PL16C/PL19C) K5(PL12C/PL17C/PL21C) K6(PL10D/PL14D/PL16D) L1(PL11A/PL16A/PL19A) L2(PL12A/PL17A/PL22A_||_PCLKT3_0) L3(PL11B/PL16B/PL19B) L4(PL12D/PL17D/PL21D) L5(PL11D/PL16D/PL19D) M1(PL12B/PL17B/PL22B_||_PCLKC3_0) M2(PL14A/PL20A/PL25A) M3(PL13A/PL19A/PL24A) N1(PL13B/PL19B/PL24B) N2(PL13C/PL18C/PL23C) N3(PL14B/PL20B/PL25B) P1(PL13D/PL18D/PL23D) P2(PL14D/PL20D/PL25D) R1(PL14C/PL20C/PL25C)

### Notes on the sheet
- Title
- Size:
- Date:
- A3
- Number:
- Time:
- Revision:
- Sheet
- of
- File:
- (in symbol LCMXO3L-1K/2K/4K/7K-BG256, part D) BANK3; 1K-2K/4K/7K || 2nd_Fn.
- (in symbol LCMXO3L-1K/2K/4K/7K-BG256, part E) BANK4; 1K-2K/4K/7K || 2nd_Fn.
- (in symbol LCMXO3L-1K/2K/4K/7K-BG256, part F) BANK5; 1K-2K/4K/7K || 2nd_Fn.

### Library data of the parts
C20-C28 = CMP-2006-03067-1: as C2 on sheet Bank0_I_O; Part Number: C0603C104M4RACTU; Package / Case: 0603
U1 = LCMXO3L-1K/2K/4K/7K-BG256: as U1 on sheet Bank2_I_O; Digikey P/N: 220-1886-ND; Location Y-Coordinate: 0; Color: Default; Source Package: LCMXO3L-1K/2K/4K/7K-BG256; Graphic: LCMXO3L-1K/2K/4K/7K-BG256A.Normal; Manufacturer Part Number: LCMXO3L-6900C-5BG256C

## Sheet bluetooth.SchDoc
size A3
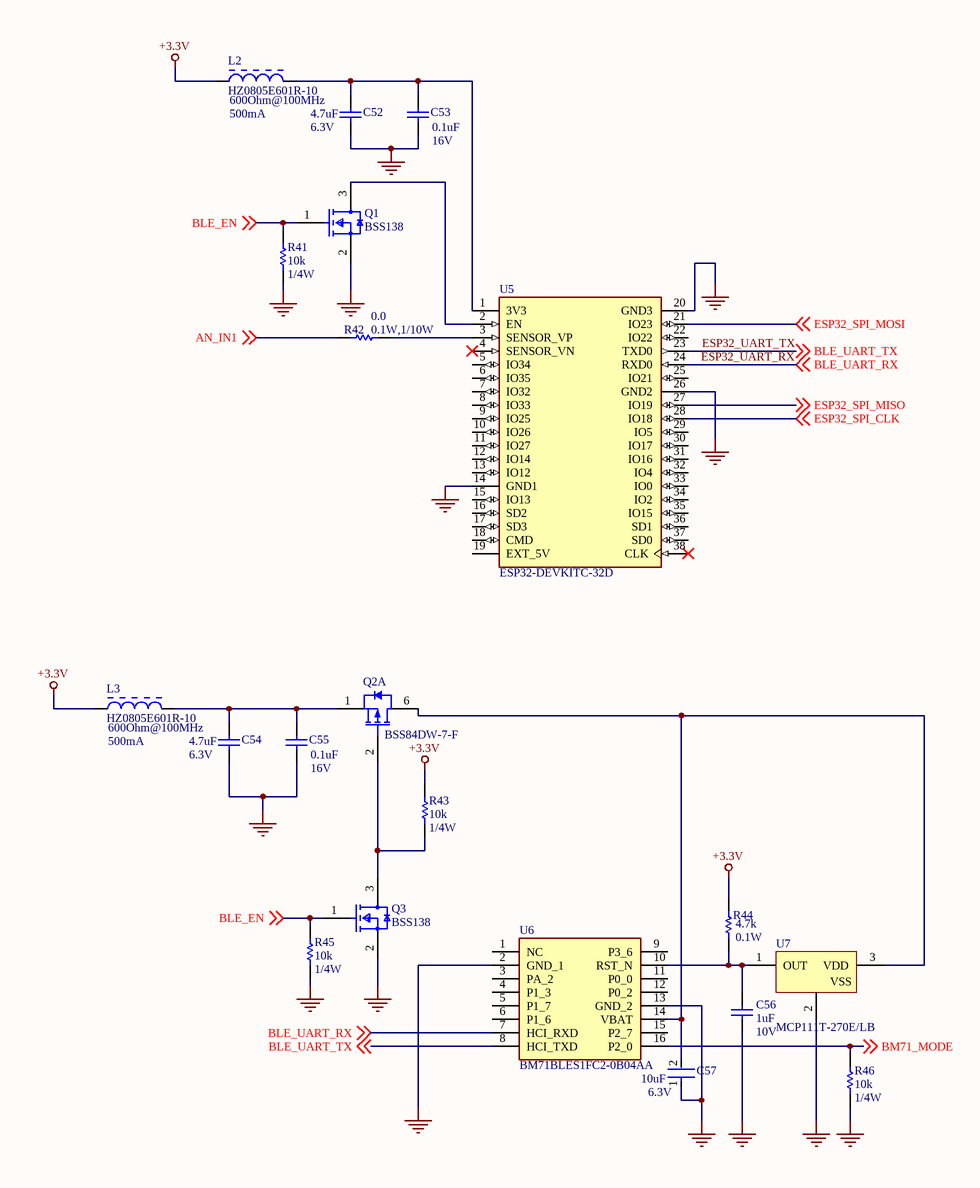
[diagram p4: bluetooth.SchDoc]

### Parts
C52  value 4.7uF  Voltage: 6.3V  [CAPC2013X145X50NL20T25]  (hidden comment: C0805C475K9PACTU)
C53  value 0.1uF  Voltage: 16V  [CAPC1608X87X35ML15T15]  (hidden comment: C0603C104M4RACTU)
C54  value 4.7uF  Voltage: 6.3V  [CAPC2013X145X50NL20T25]  (hidden comment: C0805C475K9PACTU)
C55  value 0.1uF  Voltage: 16V  [CAPC1608X87X35ML15T15]  (hidden comment: C0603C104M4RACTU)
C56  value 1uF  Voltage: 10V  [CAPC1608X90X35ML15T15]  (hidden comment: C0603C105K8RACTU)
C57  value 10uF  Voltage: 6.3V  [FP-CL10-IPC_C]  (hidden comment: CL10A106MQ8NNNC)
L2  HZ0805E601R-10  Impedance @ Frequency: 600Ohm@100MHz  Current Rating (Max): 500mA  [LIRD-LI0805H151R-10-2_V]
L3  HZ0805E601R-10  Impedance @ Frequency: 600Ohm@100MHz  Current Rating (Max): 500mA  [LIRD-LI0805H151R-10-2_V]
Q1  BSS138  [FP-318-08-IPC_B]
Q2  BSS84DW-7-F  [DIOD-SOT363-6_V]  (part A of 2)
Q3  BSS138  [FP-318-08-IPC_B]
R41  value 10k  Power: 1/4W  [RESC3216X70X50NL05T20]  (hidden comment: ERJ-8GEYJ103V)
R42  value 0.0  Power: 0.1W,1/10W  [RESC1608X55X35LL10T10]  (hidden comment: RC1608J000CS)
R43  value 10k  Power: 1/4W  [RESC3216X70X50NL05T20]  (hidden comment: ERJ-8GEYJ103V)
R44  value 4.7k  Power: 0.1W  [RESC1608X55X25LL10T15]  (hidden comment: RC0603FR-074K7L)
R45  value 10k  Power: 1/4W  [RESC3216X70X50NL05T20]  (hidden comment: ERJ-8GEYJ103V)
R46  value 10k  Power: 1/4W  [RESC3216X70X50NL05T20]  (hidden comment: ERJ-8GEYJ103V)
U5  ESP32-DEVKITC-32D  [MODULE_ESP32-DEVKITC-32D]
U6  BM71BLES1FC2-0B04AA  [BM71BLES1FC2_1]
U7  MCP111T-270E/LB  [SC70-LB3_N]

### Nets
+3.3V: L2.1 L3.1 R43.1 R44.2
GND: C52.1 C53.1 C54.1 C55.1 C56.1 C57.1 Q1.2(S) Q3.2(S) R41.2 R45.2 R46.2 U5.14(GND1) U5.20(GND3) U5.26(GND2) U6.2(GND_1) U6.13(GND_2) U7.2(VSS)
AN_IN1: R42.1 ; off-sheet AN_IN1  [project net COMP_IN1]
BLE_EN: Q1.1(G) Q3.1(G) R41.1 R45.1 ; off-sheet BLE_EN  [project net IO_T14]
BM71_MODE: R46.1 U6.16(P2_0) ; off-sheet BM71_MODE
ESP32_SPI_CLK: U5.28(IO18) ; off-sheet ESP32_SPI_CLK  [project net MCLK]
ESP32_SPI_MISO: U5.27(IO19) ; off-sheet ESP32_SPI_MISO  [project net SISPI]
ESP32_SPI_MOSI: U5.21(IO23) ; off-sheet ESP32_SPI_MOSI  [project net SPISO]
ESP32_UART_RX: U5.24(RXD0) U6.7(HCI_RXD) ; off-sheet BLE_UART_RX  [also labelled BLE_UART_RX]
ESP32_UART_TX: U5.23(TXD0) U6.8(HCI_TXD) ; off-sheet BLE_UART_TX  [also labelled BLE_UART_TX]
NetC52_2: C52.2 C53.2 L2.2 U5.1(3V3)
NetC54_2: C54.2 C55.2 L3.2 Q2.1(S)
NetC56_2: C56.2 R44.1 U6.10(RST_N) U7.1(OUT)
NetC57_2: C57.2 Q2.6(D) U6.14(VBAT) U7.3(VDD)
NetQ1_3: Q1.3(D) U5.2(EN)
NetQ2_2: Q2.2(G) Q3.3(D) R43.2
NetR42_2: R42.2 U5.3(SENSOR_VP)

Not connected (* = marked no-connect by the designer): U5 4(SENSOR_VN)* 5(IO34) 6(IO35) 7(IO32) 8(IO33) 9(IO25) 10(IO26) 11(IO27) 12(IO14) 13(IO12) 15(IO13) 16(SD2) 17(SD3) 18(CMD) 19(EXT_5V) 22(IO22) 25(IO21) 29(IO5) 30(IO17) 31(IO16) 32(IO4) 33(IO0) 34(IO2) 35(IO15) 36(SD1) 37(SD0) 38(CLK)*; U6 1(NC) 3(PA_2) 4(P1_3) 5(P1_7) 6(P1_6) 9(P3_6) 11(P0_0) 12(P0_2) 15(P2_7)

### Notes on the sheet
- Title
- Size:
- Date:
- A3
- Number:
- Time:
- Revision:
- Sheet
- of
- File:

### Library data of the parts
C52 C54 = CMP-2007-01009-1: Manufacturer: Kemet; Alternative1: GRM219R61A475KE34D Murata; Alternative2: C0805C475K3PACTU KEMET; Alternative3: CC0805KKX5R7BB475 Yageo; Part Number: C0805C475K9PACTU; Package / Case: 0805
C53 C55 = CMP-2006-03067-1: as C2 on sheet Bank0_I_O; Part Number: C0603C104M4RACTU; Package / Case: 0603
C56 = CMP-2006-02293-1: Manufacturer: Kemet; Alternative1: CL10B105KO8NNND Samsung; Alternative2: CC0603KPX7R7BB105 Yageo; Alternative3: GRM188R71C105KE15D Murata; Part Number: C0603C105K8RACTU; Package / Case: 0603
C57 = CMP-13271-001938-1: Cap Ceramic 10uF 6.3V X5R ±20% Pad SMD 0603 +85°C T/R; Manufacturer: Samsung; Alternative1: LMK107BJ106MALTD Taiyo Yuden; Alternative2: C1608X5R0J106K080AB TDK; Alternative3: 06036D106MAT2A Kyocera AVX; Height: 0.8mm; Width: 0.031inch; Min Operating Temperature: -55°C; Dielectric: X5R; Package / Case: 0603; Radiation Hardening: No; Packaging: Tape and Reel; Max Operating Temperature: 85°C; Thickness: 0.035inch; Mount: Surface Mount; Case Code (Imperial): 0603; Case Code (Metric): 1608; Depth: 0.8mm; Tolerance: 20%; Length: 1.6mm; Part Number: CL10A106MQ8NNNC
L2 L3 = CMP-2000-05194-1: Chip Bead for Signal Filtering, 600 Ohm, 500 mA, -40 to 125 degC, 0805 (2012 Metric), RoHS, Tape and Reel; Manufacturer: Laird; Other Names: 240-2399-1; Kits: 240-2227-ND-KITEMIFERRITEBEADCHIPSMD; DC Resistance (DCR) (Max): 300mOhm; Filter Type: SignalLine; Operating Temperature: -40degC~125degC; Datasheet URL: https://datasheet.ciiva.com/22622/1685710-22622833.pdf; Mounting Type: SurfaceMount; Package / Case: 0805(2012Metric); Package Description: 2-Pin Surface Mount Device, Body 2 x 1.25 mm; Package Reference: LI0805H15R-10-2; Size / Dimension: 0.079"Lx0.049"W(2.00mmx1.25mm); Height (Max): 0.043"(1.10mm); Part Number: HZ0805E601R-10
Q1 Q3 = CMP-07173-000101-1: MOSFET N-CH 50V 220MA SOT-23; Turn-Off Delay Time: 20ns; Element Configuration: Single; Rds On Max: 3.5R; Gate to Source Voltage (Vgs): 20V; Threshold Voltage: 1.3V; Number of Elements: 1; Power Dissipation: 360mW; Rise Time: 9ns; Turn-On Delay Time: 2.5ns; Input Capacitance: 27pF; On-State Resistance: 6R; Alternative1: BSS138LT3G ON Semiconductor; Alternative2: BSS138W-7-F Diodes; Alternative3: 2N7002 STMicroelectronics; Lead Free: Lead Free; Length: 2.92mm; Width: 1.3mm; Drain to Source Breakdown Voltage: 50V; Min Operating Temperature: -55°C; REACH SVHC: No SVHC; Packaging: Tape and Reel; Radiation Hardening: No; Height: 0.93mm; Drain to Source Voltage (Vdss): 50V; Current Rating: 220mA; Voltage Rating (DC): 50V; Weight: 0.03g; Continuous Drain Current (ID): 220mA; Number of Pins: 3; Nominal Vgs: 1.3V; Max Power Dissipation: 360mW; Fall Time: 9ns; Drain to Source Resistance: 3.5R; Contact Plating: Tin; Case/Package: SOT-23; Package Quantity: 1; Dual Supply Voltage: 50V; Mount: Surface Mount; Termination: SMD/SMT; Max Operating Temperature: 150°C
Q2 = CMP-2000-05971-1: Dual P-Channel Enhancement Mode MOSFET, 50 VDS, -55 to 150 degC, 6-Pin SOT363, RoHS, Tape and Reel; Manufacturer: DiodesIncorporated; Vgs - Gate-Source Voltage: 20V; Typical Turn-On Delay Time: 10ns; Forward Transconductance - Min: 0.05S; Id - Continuous Drain Current: -130mA; Transistor Type: 2P-Channel; Typical Turn-Off Delay Time: 18ns; Unit Weight: 0.000212oz; Vds - Drain-Source Breakdown Voltage: -50V; Number of Channels: 2Channel; Pd - Power Dissipation: 300mW; Type: EnhancementModeFieldEffectTransistor; Rds On - Drain-Source Resistance: 6Ohms; Package Description: 6-Pin Small Outline Transistor, Body 1.25 x 2 mm, Pitch 0.65 mm; RoHS: True; Manufacturer URL: http://www.diodes.com/; Packaging: Reel; Series: BSS84; Mounting Style: SMD/SMT; Technology: Si; Height: 1mm; Configuration: Dual; Package Reference: SOT363-6; Length: 2.2mm; Mounting Technology: SurfaceMount; Factory Pack Quantity: 3000; Brand: DiodesIncorporated; Maximum Operating Temperature: +150C; Minimum Operating Temperature: -55C; Product Category: MOSFET; Datasheet URL: http://www.diodes.com/_files/datasheets/ds30204.pdf; Width: 1.35mm; Product: MOSFETSmallSignal; Channel Mode: Enhancement; Transistor Polarity: P-Channel; Datasheet Version: Rev. 18-2, 01/2014; Package / Case: SOT-363-6
R41 R43 R45 R46 = CMP-2003-00545-1: as R7 on sheet Bank0_I_O; Part Number: ERJ-8GEYJ103V; Package / Case: 1206
R42 = CMP-2000-06972-1: as R16 on sheet Bank2_I_O; Manufacturer URL: http://www.samsungsem.com/global/index.jsp; Features: MoistureResistant; Mounting Technology: SurfaceMount; Series: RC; Package / Case: 0603(1608Metric); Category: Resistors; Operating Temperature: -55°C~155°C; Datasheet URL: http://static6.arrow.com/aropdfconversion/3cece72dd289ffbadc164fbcd05f638dd7240f7b/rc_datasheet_150330.pdf.pdf?authToken=eyJ0eXAiOiJKV1QiLCJhbGciOiJIUzI1NiJ9.eyJTZXNzaW9uSWQiOiJtY3ZlYXdxYmptZXdpdXdyeG1ha2FxdWciLCJEb3dubG9hZFR5cGUiOiJEYXRhc2hlZXRzIiwiaXNzIjoic2VsZiIsImF1ZCI6Imh0dHA6Ly9kYXRhc2hlZXRhdXRoLmFycm93LmNvbSIsImV4cCI6MTQ3Njg1OTQ5NiwibmJmIjoxNDc2ODU5Mzc2fQ.1rZWSrRNyHkP6J5YmszFzS2kzmlbN9BKNvWJ4ACiP-Q; Datasheet Version: 09/2015; Composition: ThickFilm; Package Description: 2-Pin Chip Resistor, Body 1.6 x 0.8 mm; Height: 0.022"(0.55mm); Family: ChipResistor-SurfaceMount; Temperature Coefficient: -; Size / Dimension: 0.063"Lx0.031"W(1.60mmx0.80mm); Part Number: RC1608J000CS
R44 = CMP-2000-06942-1: Chip Resistor, 4.7 KOhm, +/- 1%, 0.1 W, -55 to 155 degC, 0603 (1608 Metric), RoHS, Tape and Reel; Manufacturer: Yageo; Temperature Coefficient: 100PPM/C; Voltage Rating: 50V; Package / Case: 0603; Series: RC; Datasheet URL: http://www.yageo.com/documents/recent/PYu-RC_Group_51_RoHS_L_7.pdf; Case Code - mm: 1608; Operating Temperature Range: -55Cto+155C; Tolerance: 1%
U5 = ESP32-DEVKITC-32D: - Transceiver; 802.11 b/g/n _Wi-Fi, WiFi, WLAN_, BluetoothÂ® Smart Ready 4.x Dual Mode For Use With ESP-WROOM-32; MF: Espressif Systems; Package: None; Price: None; Availability: Unavailable; MP: ESP32-DEVKITC-32D; SnapEDA_Link: https://www.snapeda.com/parts/ESP32-DEVKITC-32D/Espressif%20Systems/view-part/2777395/?ref=snap; Value: *
U6 = BM71BLES1FC2-0B04AA: Integrated Circuit; Manufacturer_Name: Microchip; Datasheet Link: http://www.microchip.com/mymicrochip/filehandler.aspx?ddocname=en578477; Manufacturer_Part_Number: BM71BLES1FC2-0B04AA; Arrow Part Number: BM71BLES1FC2-0B04AA; Arrow Price/Stock: https://www.arrow.com/en/products/bm71bles1fc2-0b04aa/microchip-technology; Mouser Part Number: 579-BM71BS1FC2-BB04; Mouser Price/Stock: https://www.mouser.co.uk/ProductDetail/Microchip-Technology/BM71BLES1FC2-0B04AA?qs=w%2Fv1CP2dgqqgFQsF1zIUBg%3D%3D
U7 = CMP-0130-00048-1: 1.75Î¼A Micropower Voltage Detector, Open-Drain Output, 2.63V, 3-Pin SC-70, Extended Temperature, Tape and Reel; PackageVersion: revBB, Aug-2009; PackageReference: SC70-LB3; DatasheetVersion: revD, Jun-2005; PackageDescription: 3-Lead Plastic Small Outline Transistor (LB) [SC70]

## Sheet DC-DC-Converters.SchDoc
size A3
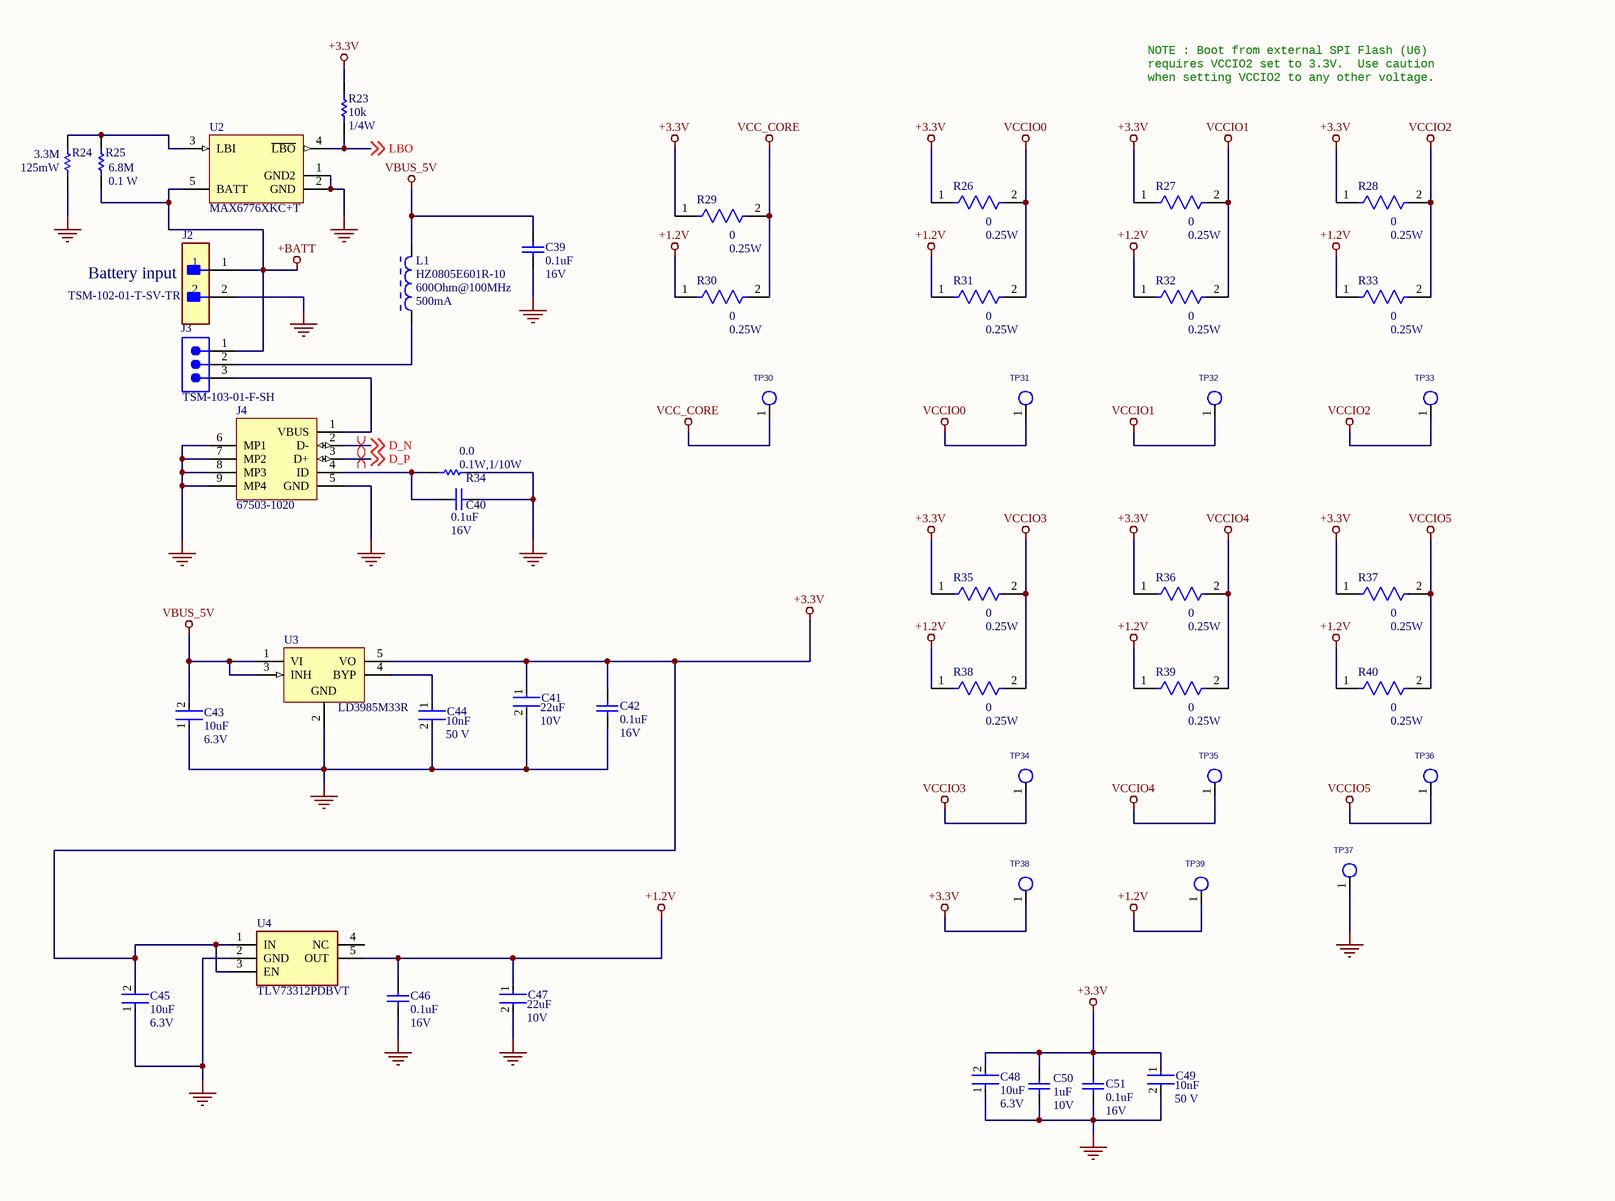
[diagram p5: DC-DC-Converters.SchDoc]

### Parts
C39  value 0.1uF  Voltage: 16V  [CAPC1608X87X35ML15T15]  (hidden comment: C0603C104M4RACTU)
C40  value 0.1uF  Voltage: 16V  [CAPC1608X87X35ML15T15]  (hidden comment: C0603C104M4RACTU)
C41  value 22uF  Voltage: 10V  [FP-GRM188-0_2-IPC_C]  (hidden comment: GRM188R61A226ME15D)
C42  value 0.1uF  Voltage: 16V  [CAPC1608X87X35ML15T15]  (hidden comment: C0603C104M4RACTU)
C43  value 10uF  Voltage: 6.3V  [FP-CL10-IPC_C]  (hidden comment: CL10A106MQ8NNNC)
C44  value 10nF  Voltage: 50 V  [FP-C0805C-DN-MFG]  (hidden comment: C0805C103K5RACAUTO)
C45  value 10uF  Voltage: 6.3V  [FP-CL10-IPC_C]  (hidden comment: CL10A106MQ8NNNC)
C46  value 0.1uF  Voltage: 16V  [CAPC1608X87X35ML15T15]  (hidden comment: C0603C104M4RACTU)
C47  value 22uF  Voltage: 10V  [FP-GRM188-0_2-IPC_C]  (hidden comment: GRM188R61A226ME15D)
C48  value 10uF  Voltage: 6.3V  [FP-CL10-IPC_C]  (hidden comment: CL10A106MQ8NNNC)
C49  value 10nF  Voltage: 50 V  [FP-C0805C-DN-MFG]  (hidden comment: C0805C103K5RACAUTO)
C50  value 1uF  Voltage: 10V  [CAPC1608X90X35ML15T15]  (hidden comment: C0603C105K8RACTU)
C51  value 0.1uF  Voltage: 16V  [CAPC1608X87X35ML15T15]  (hidden comment: C0603C104M4RACTU)
J2  TSM-102-01-T-SV-TR  [FP-TSM-102-01-T-SV-TR-MFG]
J3  TSM-103-01-F-SH  [SMTC-TSM-103-01-X-SH-A]
J4  67503-1020  [MOLX-67503-1020_V]
L1  HZ0805E601R-10  Impedance @ Frequency: 600Ohm@100MHz  Current Rating (Max): 500mA  [LIRD-LI0805H151R-10-2_V]
R23  value 10k  Power: 1/4W  [RESC3216X70X50NL05T20]  (hidden comment: ERJ-8GEYJ103V)
R24  value 3.3M  Power: 125mW  [RESC2013X50X30LL20T20]  (hidden comment: CRCW08053M30FKEA)
R25  value 6.8M  Power: 0.1 W  [RESC0603(1608)_L]  (hidden comment: 6M8 5% 0603(1608))
R26  value 0  Power: 0.25W  [FP-RC1206-MFG]  (hidden comment: RC1206JR-070RL)
R27  value 0  Power: 0.25W  [FP-RC1206-MFG]  (hidden comment: RC1206JR-070RL)
R28  value 0  Power: 0.25W  [FP-RC1206-MFG]  (hidden comment: RC1206JR-070RL)
R29  value 0  Power: 0.25W  [FP-RC1206-MFG]  (hidden comment: RC1206JR-070RL)
R30  value 0  Power: 0.25W  [FP-RC1206-MFG]  (hidden comment: RC1206JR-070RL)
R31  value 0  Power: 0.25W  [FP-RC1206-MFG]  (hidden comment: RC1206JR-070RL)
R32  value 0  Power: 0.25W  [FP-RC1206-MFG]  (hidden comment: RC1206JR-070RL)
R33  value 0  Power: 0.25W  [FP-RC1206-MFG]  (hidden comment: RC1206JR-070RL)
R34  value 0.0  Power: 0.1W,1/10W  [RESC1608X55X35LL10T10]  (hidden comment: RC1608J000CS)
R35  value 0  Power: 0.25W  [FP-RC1206-MFG]  (hidden comment: RC1206JR-070RL)
R36  value 0  Power: 0.25W  [FP-RC1206-MFG]  (hidden comment: RC1206JR-070RL)
R37  value 0  Power: 0.25W  [FP-RC1206-MFG]  (hidden comment: RC1206JR-070RL)
R38  value 0  Power: 0.25W  [FP-RC1206-MFG]  (hidden comment: RC1206JR-070RL)
R39  value 0  Power: 0.25W  [FP-RC1206-MFG]  (hidden comment: RC1206JR-070RL)
R40  value 0  Power: 0.25W  [FP-RC1206-MFG]  (hidden comment: RC1206JR-070RL)
TP30  tp_s_40_63  [tp_s_40_63]  (value not drawn)
TP31  tp_s_40_63  [tp_s_40_63]  (value not drawn)
TP32  tp_s_40_63  [tp_s_40_63]  (value not drawn)
TP33  tp_s_40_63  [tp_s_40_63]  (value not drawn)
TP34  tp_s_40_63  [tp_s_40_63]  (value not drawn)
TP35  tp_s_40_63  [tp_s_40_63]  (value not drawn)
TP36  tp_s_40_63  [tp_s_40_63]  (value not drawn)
TP37  tp_s_40_63  [tp_s_40_63]  (value not drawn)
TP38  tp_s_40_63  [tp_s_40_63]  (value not drawn)
TP39  tp_s_40_63  [tp_s_40_63]  (value not drawn)
U2  MAX6776XKC+T  [X5+1_N]
U3  LD3985M33R  [SOT23-5L_N]
U4  TLV73312PDBVT  [SOT95P280X145-5N]

### Nets
+1.2V: C46.1 C47.1 R30.1 R31.1 R32.1 R33.1 R38.1 R39.1 R40.1 TP39.1(TP) U4.5(OUT)
+3.3V: C41.1 C42.1 C45.2 C48.2 C49.1 C50.2 C51.1 R23.1 R26.1 R27.1 R28.1 R29.1 R35.1 R36.1 R37.1 TP38.1(TP) U3.5(VO) U4.1(IN) U4.3(EN)
+BATT: J2.1 J3.1 R25.1 U2.5(BATT)
GND: C39.2 C40.1 C41.2 C42.2 C43.1 C44.2 C45.1 C46.2 C47.2 C48.1 C49.2 C50.1 C51.2 J2.2 J4.5(GND) J4.6(MP1) J4.7(MP2) J4.8(MP3) J4.9(MP4) R24.1 R34.2 TP37.1(TP) U2.1(GND2) U2.2(GND) U3.2(GND) U4.2(GND)
VBUS_5V: C39.1 C43.2 L1.2 U3.1(VI) U3.3(INH)
VCC_CORE: R29.2 R30.2 TP30.1(TP)
VCCIO0: R26.2 R31.2 TP31.1(TP)
VCCIO1: R27.2 R32.2 TP32.1(TP)
VCCIO2: R28.2 R33.2 TP33.1(TP)
VCCIO3: R35.2 R38.2 TP34.1(TP)
VCCIO4: R36.2 R39.2 TP35.1(TP)
VCCIO5: R37.2 R40.2 TP36.1(TP)
D_N: J4.2(D-) ; off-sheet D_N
D_P: J4.3(D+) ; off-sheet D_P
LBO: R23.2 U2.4(~{LBO}) ; off-sheet LBO
NetC40_2: C40.2 J4.4(ID) R34.1
NetC44_1: C44.1 U3.4(BYP)
NetJ3_2: J3.2 L1.1
NetJ3_3: J3.3 J4.1(VBUS)
NetR24_2: R24.2 R25.2 U2.3(LBI)

Not connected (* = marked no-connect by the designer): U4 4(NC)

### Layout directives
differential pair; differential pair class USB; rule Differential Pairs Routing [Pref Gap = 10mil    Min Gap  = 10mil    Max Gap  = 10milPref Width = 14.334mil    Min Width  = 14.334mil    Max Width  = 15mil]: D_N, D_P

### Notes on the sheet
- NOTE : Boot from external SPI Flash (U6)
  requires VCCIO2 set to 3.3V.  Use caution
  when setting VCCIO2 to any other voltage.
- (near J2) Battery input
- Title
- Size:
- Date:
- A3
- Number:
- Time:
- Revision:
- Sheet
- of
- File:

### Library data of the parts
C39 C40 C42 C46 C51 = CMP-2006-03067-1: as C2 on sheet Bank0_I_O; Part Number: C0603C104M4RACTU; Package / Case: 0603
C41 C47 = CMP-06035-000033-2: Chip Multilayer Ceramic Capacitors for General Purpose, 0603, 22uF, X5R, 15%, 20%, 10V; Alternative1: GRM21BR72A103KA01L Murata; Alternative2: C0805F103K5RACTU KEMET; Alternative3: 08055C103JAT2A Kyocera AVX; Tolerance: 20%; Material: Ceramic; Termination: SMD/SMT; Packaging: Tape and Reel; Width: 0.8mm; Case Code (Imperial): 0603; Mount: Surface Mount; Package / Case: 0603; Dielectric: X5R; Package Quantity: 4000; Case Code (Metric): 1608; Min Operating Temperature: -55°C; Lead Free: Lead Free; Max Operating Temperature: 85°C; Part Number: GRM188R61A226ME15D
C43 C45 C48 = CMP-13271-001938-1: as C57 on sheet bluetooth; Height: 0.8mm; Width: 0.031inch; Min Operating Temperature: -55°C; Dielectric: X5R; Package / Case: 0603; Radiation Hardening: No; Packaging: Tape and Reel; Max Operating Temperature: 85°C; Thickness: 0.035inch; Mount: Surface Mount; Case Code (Imperial): 0603; Case Code (Metric): 1608; Depth: 0.8mm; Tolerance: 20%; Length: 1.6mm; Part Number: CL10A106MQ8NNNC
C44 C49 = CMP-03020-006206-1: as C1 on sheet Bank0_I_O; Height: 0.88mm; Temperature Characteristic: X7R; Part Number: C0805C103K5RACAUTO; ComponentLink2URL: https://content.kemet.com/datasheets/KEM_C1003_C0G_SMD.pdf; RoHS: TRUE; Temperature: -55°C to +125°C; Temperature Range Low: -55°C; ComponentLink2Description: Datasheet; Package / Case: C0805C-DN; Lead Free: Yes
C50 = CMP-2006-02293-1: as C56 on sheet bluetooth; Part Number: C0603C105K8RACTU; Package / Case: 0603
J2 = CMP-02766-000113-1: CONN HEADER SMD 2POS 2.54MM; Gender: Male; Max Voltage Rating (AC): 475V; Number of Contacts: 2; Max Current Rating: 7A; Contact Material: Bronze; Min Operating Temperature: -55°C; REACH SVHC: No SVHC; Housing Material: Polymer; Lead Free: Lead Free; Orientation: Straight; Radiation Hardening: No; Number of Rows: 1; Length: 5.08mm; Housing Color: Black; Max Operating Temperature: 105°C; Contact Plating: Tin; Depth: 2.54mm; Packaging: Tape and Reel; Pitch: 2.54mm; Termination: Solder
J3 = CMP-1024-00212-1: 0.025" SQ Post Header, Surface Mount, Horizontal, -55 to 125 degC, 2.54 mm Pitch, 3-Pin, Male, RoHS; Manufacturer: Samtec; Pitch: 2.54 mm; ComponentLink1Description: Manufacturer URL; Temperature Range: -55 to 125 degC; Part Number: TSM-103-01-F-SH; Orientation: Horizontal; ComponentLink1URL: http://www.samtec.com; ComponentLink2Description: Datasheet; Mounting Technology: Surface Mount; RoHS: True; ComponentLink3URL: http://www.samtec.com/documents/webfiles/cpdf/TSM-1XX-XX-XXX-SH-XX-XXX-XX-MKT1.pdf; ComponentLink3Description: Package Specification; ComponentLink2URL: http://www.samtec.com/documents/webfiles/pdf/TSM.PDF
J4 = CMP-0411-00002-1: USB, MINI, SMD, RA KME04-USBMU03A01; Manufacturer: Molex; ComponentLink1URL: http://www.molex.com/; Part Number: 67503-1020; Mounting Technology: Surface Mount; ComponentLink1Description: Manufacturer URL; Terminal Pitch: 0.8 mm; DatasheetVersion: Rev F, 06/2009; ComponentLink2Description: Datasheet; PackageDescription: Mini USB Connector, SMT, Righer Angle; ComponentLink2URL: http://www.molex.com/pdm_docs/sd/675031020_sd.pdf; PackageReference: 67503-1020
L1 = CMP-2000-05194-1: as L2 on sheet bluetooth; Operating Temperature: -40degC~125degC; Datasheet URL: https://datasheet.ciiva.com/22622/1685710-22622833.pdf; Mounting Type: SurfaceMount; Package / Case: 0805(2012Metric); Package Description: 2-Pin Surface Mount Device, Body 2 x 1.25 mm; Package Reference: LI0805H15R-10-2; Size / Dimension: 0.079"Lx0.049"W(2.00mmx1.25mm); Height (Max): 0.043"(1.10mm); Part Number: HZ0805E601R-10
R23 = CMP-2003-00545-1: as R7 on sheet Bank0_I_O; Part Number: ERJ-8GEYJ103V; Package / Case: 1206
R24 = CMP-2001-03892-1: Manufacturer: Vishay Dale; Alternative1: CRCW08050000Z0EA Vishay; Alternative2: CRCW080512K0FKEA Vishay; Alternative3: CRCW08054K70FKEA Vishay; Part Number: CRCW08053M30FKEA; Package / Case: 0805
R25 = CMP-1012-00166-1: 6M8 0.1W 5% 0603 (1608 Metric)  SMD; Part Number: ERJ-3GEYJ685V; Alternative1: CR0603-JW-685ELF; Alternative2: RMCF0603JT6M80 Stackpole Electronics; Alternative3: CRCW06036M80JNEA Vishay Dale; Package / Case: 0603; Tolerance: 5 %
R26-R33 R35-R40 = CMP-03412-007570-1: RES SMD 0 OHM JUMPER 1/4W 1206; Manufacturer: YAGEO; Voltage Rating: 200V; Temperature Coefficient: 300ppm/°C; Tolerance: 5%; Alternative1: RC1206JR-100R Yageo; Alternative2: ERJ8GEY0R00V Panasonic; Alternative3: CRCW12060000Z0EC Vishay Dale; Part Number: RC1206JR-070RL; Temperature: -55°C to +155°C; ComponentLink2URL: https://www.yageo.com/upload/media/product/productsearch/datasheet/rchip/PYu-RC_Group_51_RoHS_L_10.pdf; Lead Free: Yes; Height: 0.65mm; Package / Case: 1206; ComponentLink2Description: Datasheet; Composition: Thick Film; RoHS: TRUE
R34 = CMP-2000-06972-1: as R16 on sheet Bank2_I_O; Manufacturer URL: http://www.samsungsem.com/global/index.jsp; Features: MoistureResistant; Mounting Technology: SurfaceMount; Series: RC; Package / Case: 0603(1608Metric); Category: Resistors; Operating Temperature: -55°C~155°C; Datasheet URL: http://static6.arrow.com/aropdfconversion/3cece72dd289ffbadc164fbcd05f638dd7240f7b/rc_datasheet_150330.pdf.pdf?authToken=eyJ0eXAiOiJKV1QiLCJhbGciOiJIUzI1NiJ9.eyJTZXNzaW9uSWQiOiJtY3ZlYXdxYmptZXdpdXdyeG1ha2FxdWciLCJEb3dubG9hZFR5cGUiOiJEYXRhc2hlZXRzIiwiaXNzIjoic2VsZiIsImF1ZCI6Imh0dHA6Ly9kYXRhc2hlZXRhdXRoLmFycm93LmNvbSIsImV4cCI6MTQ3Njg1OTQ5NiwibmJmIjoxNDc2ODU5Mzc2fQ.1rZWSrRNyHkP6J5YmszFzS2kzmlbN9BKNvWJ4ACiP-Q; Datasheet Version: 09/2015; Composition: ThickFilm; Package Description: 2-Pin Chip Resistor, Body 1.6 x 0.8 mm; Height: 0.022"(0.55mm); Family: ChipResistor-SurfaceMount; Temperature Coefficient: -; Size / Dimension: 0.063"Lx0.031"W(1.60mmx0.80mm); Part Number: RC1608J000CS
TP30-TP39 = TP_S_40_63: as TP27 on sheet Bank2_I_O
U2 = CMP-0251-00617-1: Low-Power, 1%-Accurate Battery Monitor, Single LBO output, Open-Drain output, Fixed hysteresis, 5-Pin SC70, -40°C to +85°C, Pb-Free, Tape and Reel; PackageVersion: revE, 2006; PackageDescription: 5-Pin SC70 Transistor Package, 0.65 mm Pitch, 2.2 mm Lead Span; ComponentLink1URL: http://www.maxim-ic.com; ComponentLink2URL: http://datasheets.maxim-ic.com/en/ds/MAX6775-MAX6781.pdf; ComponentLink2Description: Datasheet; ComponentLink3URL: http://pdfserv.maxim-ic.com/package_dwgs/21-0076.PDF; ComponentLink1Description: Manufacturer URL; ComponentLink3Description: Package Specification; PackageReference: X5+1; DatasheetVersion: Rev 4, May-2009; Code_JEDEC: MO-203
U3 = CMP-0244-00328-1: 150mA, Ultra-Low Drop Low Noise BiCMOS Voltage Regulators Low ESR Capacitors Compatible, 3.3V, 5-Pin SOT23-5L; ComponentLink1Description: Manufacturer URL; ComponentLink2URL: http://www.st.com/internet/com/TECHNICAL_RESOURCES/TECHNICAL_LITERATURE/DATASHEET/CD00003395.pdf; PackageReference: SOT23-5L; ComponentLink1URL: http://www.st.com; ComponentLink2Description: Datasheet; PackageVersion: 1/01/2008; PackageDescription: 5-Pin SOT-23 Package, 2.9 x 1.6 mm Body, 0.95 mm Pitch, 2.8 mm Lead Span; DatasheetVersion: 3/01/2011
U4 = TLV73312PDBVT: Integrated Circuit; Manufacturer_Name: Texas Instruments; Datasheet Link: http://www.ti.com/lit/gpn/TLV733P; Height: 1.45mm; Manufacturer_Part_Number: TLV73312PDBVT; Arrow Part Number: TLV73312PDBVT; Arrow Price/Stock: https://www.arrow.com/en/products/tlv73312pdbvt/texas-instruments; Mouser Part Number: 595-TLV73312PDBVT; Mouser Price/Stock: https://www.mouser.co.uk/ProductDetail/Texas-Instruments/TLV73312PDBVT?qs=ifm8N2KdrcbA2G38xADqCw%3D%3D